# Altium project Pleiades_P01.PrjPcb (part 7 of 10)

## Sheet MOTOR_CONTROL.SchDoc
size 558 x 431 mm; SheetNumber: 13; SheetTotal: 25; Sheet_Name: MOTOR CONTROL; Size: 11x17
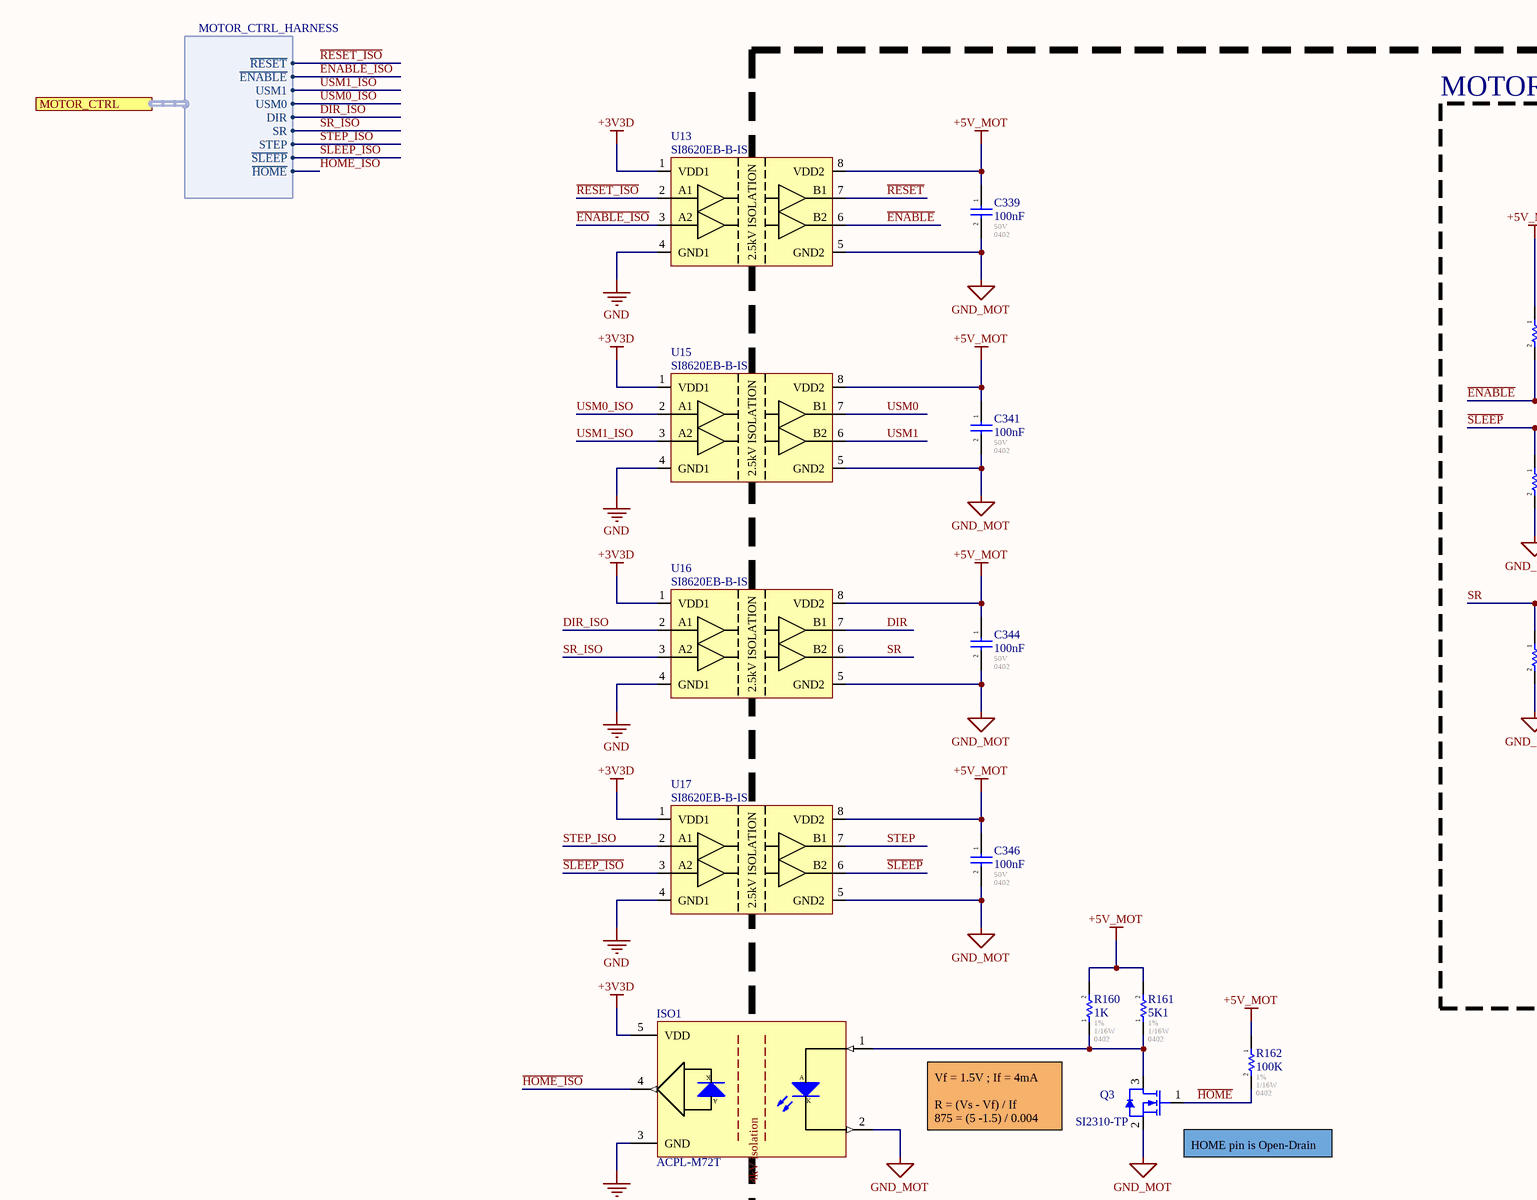
[diagram p42: MOTOR_CONTROL.SchDoc, top left]
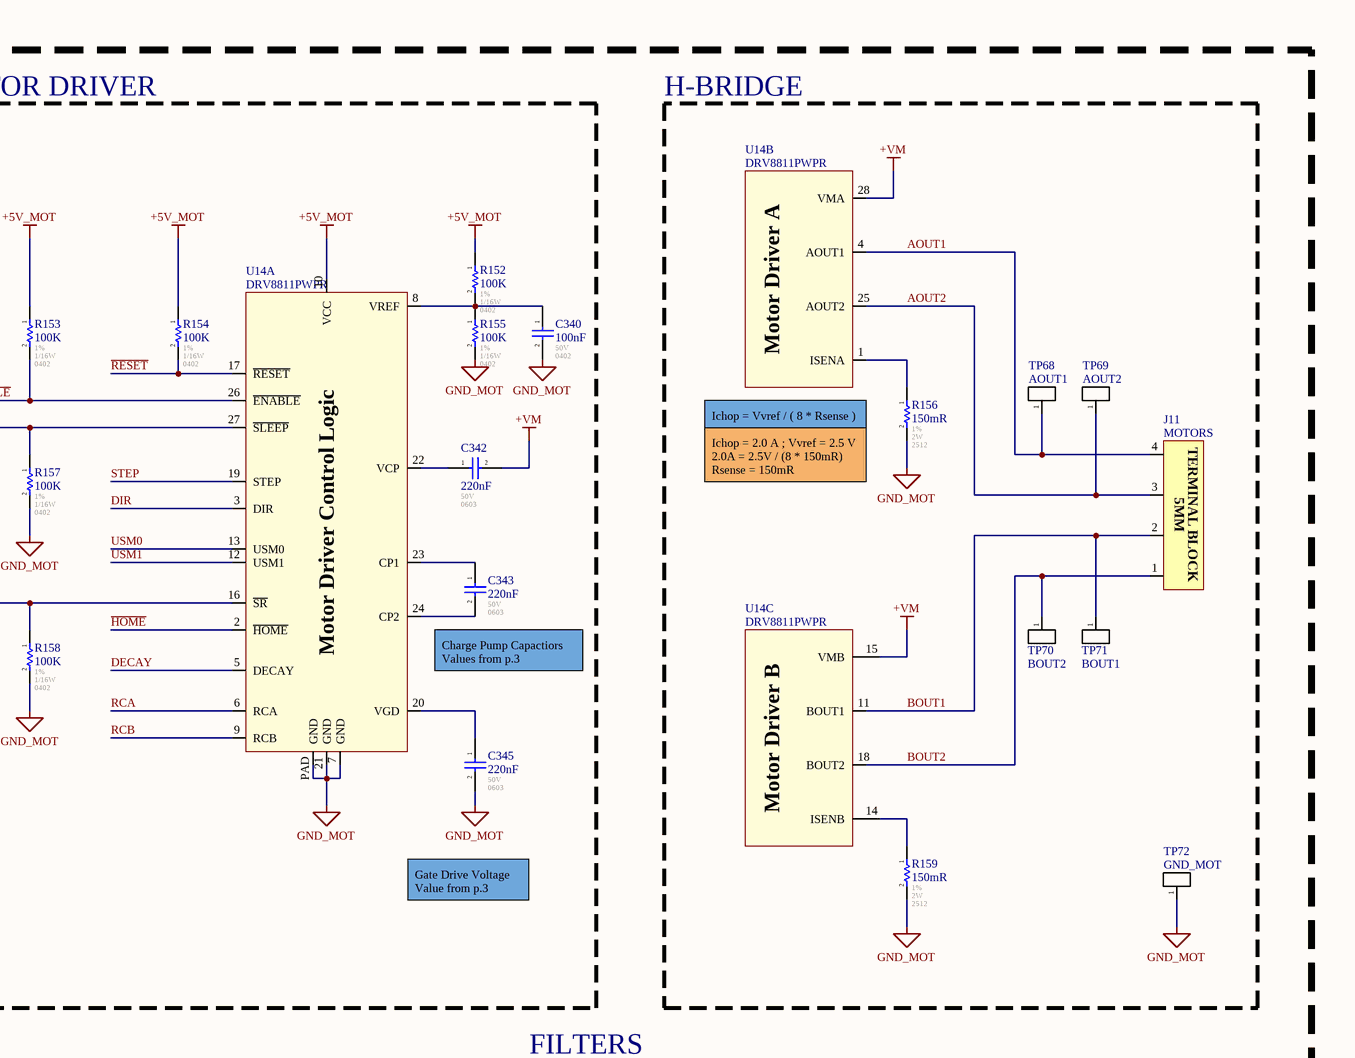
[diagram p43: MOTOR_CONTROL.SchDoc, top right]
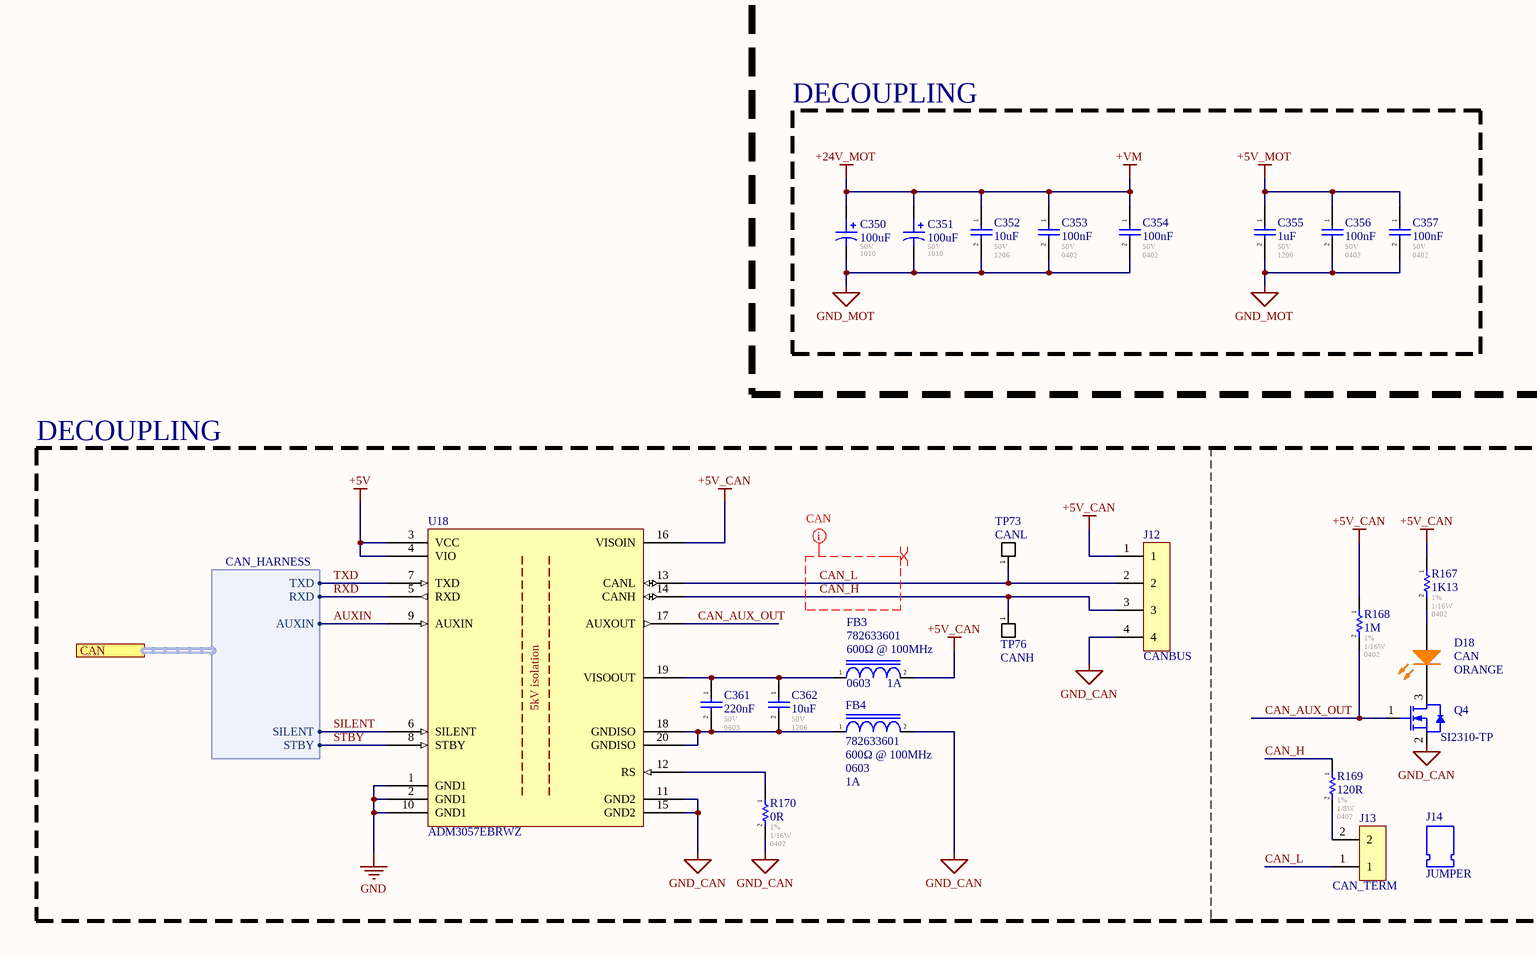
[diagram p44: MOTOR_CONTROL.SchDoc, bottom left]
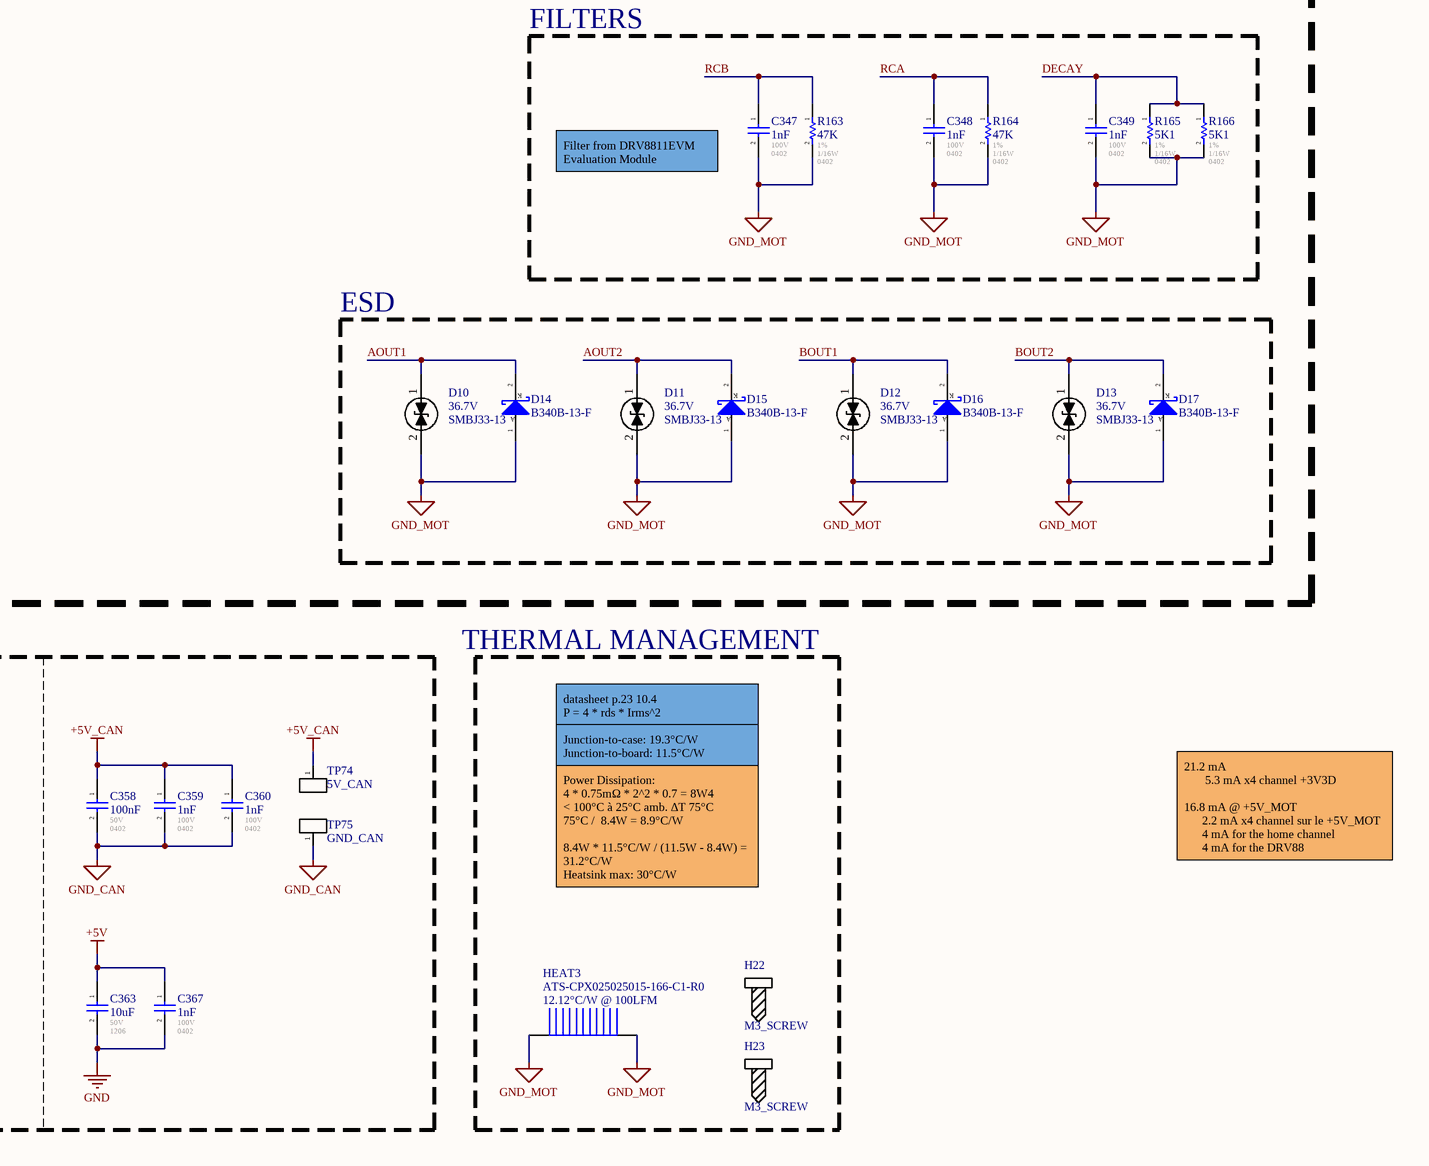
[diagram p45: MOTOR_CONTROL.SchDoc, bottom right]

### Parts
C339  100nF  Voltage - Rated: 50V  Footprint: 0402  [CAP_0402]
C340  100nF  Voltage - Rated: 50V  Footprint: 0402  [CAP_0402]
C341  100nF  Voltage - Rated: 50V  Footprint: 0402  [CAP_0402]
C342  220nF  Voltage - Rated: 50V  Footprint: 0603  [CAP_0603]
C343  220nF  Voltage - Rated: 50V  Footprint: 0603  [CAP_0603]
C344  100nF  Voltage - Rated: 50V  Footprint: 0402  [CAP_0402]
C345  220nF  Voltage - Rated: 50V  Footprint: 0603  [CAP_0603]
C346  100nF  Voltage - Rated: 50V  Footprint: 0402  [CAP_0402]
C347  1nF  Voltage - Rated: 100V  Footprint: 0402  [CAP_0402]
C348  1nF  Voltage - Rated: 100V  Footprint: 0402  [CAP_0402]
C349  1nF  Voltage - Rated: 100V  Footprint: 0402  [CAP_0402]
C350  value 100uF  Voltage: 50V  Package: 1010  [CAP_ALU_1010_vishay]  (hidden comment: MAL215099101E3)
C351  value 100uF  Voltage: 50V  Package: 1010  [CAP_ALU_1010_vishay]  (hidden comment: MAL215099101E3)
C352  10uF  Voltage - Rated: 50V  Footprint: 1206  [CAP_1206]
C353  100nF  Voltage - Rated: 50V  Footprint: 0402  [CAP_0402]
C354  100nF  Voltage - Rated: 50V  Footprint: 0402  [CAP_0402]
C355  1uF  Voltage - Rated: 50V  Footprint: 1206  [CAP_1206]
C356  100nF  Voltage - Rated: 50V  Footprint: 0402  [CAP_0402]
C357  100nF  Voltage - Rated: 50V  Footprint: 0402  [CAP_0402]
C358  100nF  Voltage - Rated: 50V  Footprint: 0402  [CAP_0402]
C359  1nF  Voltage - Rated: 100V  Footprint: 0402  [CAP_0402]
C360  1nF  Voltage - Rated: 100V  Footprint: 0402  [CAP_0402]
C361  220nF  Voltage - Rated: 50V  Footprint: 0603  [CAP_0603]
C362  10uF  Voltage - Rated: 50V  Footprint: 1206  [CAP_1206]
C363  10uF  Voltage - Rated: 50V  Footprint: 1206  [CAP_1206]
C367  1nF  Voltage - Rated: 100V  Footprint: 0402  [CAP_0402]
D10  SMBJ33-13  Voltage - Breakdown: 36.7V  [DO214AA (SMB)]
D11  SMBJ33-13  Voltage - Breakdown: 36.7V  [DO214AA (SMB)]
D12  SMBJ33-13  Voltage - Breakdown: 36.7V  [DO214AA (SMB)]
D13  SMBJ33-13  Voltage - Breakdown: 36.7V  [DO214AA (SMB)]
D14  B340B-13-F  [DO214AA (SMB)]
D15  B340B-13-F  [DO214AA (SMB)]
D16  B340B-13-F  [DO214AA (SMB)]
D17  B340B-13-F  [DO214AA (SMB)]
D18  CAN  value ORANGE  [LED_0603]
FB3  782633601  Impedance @ Freq: 600Ω @ 100MHz  Package / Case: 0603  Current Rating: 1A  [IND_0603]
FB4  782633601  Impedance @ Freq: 600Ω @ 100MHz  Package / Case: 0603  Current Rating: 1A  [IND_0603]
H22  M3_SCREW  (mechanical)
H23  M3_SCREW  (mechanical)
HEAT3  ATS-CPX025025015-166-C1-R0  Thermal Resistance: 12.12°C/W @ 100LFM  [ATS-CPX025025015-166-C1-R0]
ISO1  ACPL-M72T  [SOIC-5_4.4MM]
J11  MOTORS  [CONN_TERMINAL_OSTTA040161]
J12  CANBUS  [HEADER-4_100MIL]
J13  CAN_TERM  [HEADER-2_100MIL]
J14  JUMPER  (mechanical)
Q3  SI2310-TP  [TRX_NMOS_SI2310-TP]
Q4  SI2310-TP  [TRX_NMOS_SI2310-TP]
R152  100K  Tolerance: 1%  Power: 1/16W  Package / Case: 0402  [RES_0402]
R153  100K  Tolerance: 1%  Power: 1/16W  Package / Case: 0402  [RES_0402]
R154  100K  Tolerance: 1%  Power: 1/16W  Package / Case: 0402  [RES_0402]
R155  100K  Tolerance: 1%  Power: 1/16W  Package / Case: 0402  [RES_0402]
R156  150mR  Tolerance: 1%  Power: 2W  Package / Case: 2512  [RES_2512]
R157  100K  Tolerance: 1%  Power: 1/16W  Package / Case: 0402  [RES_0402]
R158  100K  Tolerance: 1%  Power: 1/16W  Package / Case: 0402  [RES_0402]
R159  150mR  Tolerance: 1%  Power: 2W  Package / Case: 2512  [RES_2512]
R160  1K  Tolerance: 1%  Power: 1/16W  Package / Case: 0402  [RES_0402]
R161  5K1  Tolerance: 1%  Power: 1/16W  Package / Case: 0402  [RES_0402]
R162  100K  Tolerance: 1%  Power: 1/16W  Package / Case: 0402  [RES_0402]
R163  47K  Tolerance: 1%  Power: 1/16W  Package / Case: 0402  [RES_0402]
R164  47K  Tolerance: 1%  Power: 1/16W  Package / Case: 0402  [RES_0402]
R165  5K1  Tolerance: 1%  Power: 1/16W  Package / Case: 0402  [RES_0402]
R166  5K1  Tolerance: 1%  Power: 1/16W  Package / Case: 0402  [RES_0402]
R167  1K13  Tolerance: 1%  Power: 1/16W  Package / Case: 0402  [RES_0402]
R168  1M  Tolerance: 1%  Power: 1/16W  Package / Case: 0402  [RES_0402]
R169  120R  Tolerance: 1%  Power: 1/8W  Package / Case: 0402  [RES_0402]
R170  0R  Tolerance: 1%  Power: 1/16W  Package / Case: 0402  [RES_0402]
TP68  AOUT1  [TP_HOLE]  (no BOM)
TP69  AOUT2  [TP_HOLE]  (no BOM)
TP70  BOUT2  [TP_HOLE]  (no BOM)
TP71  BOUT1  [TP_HOLE]  (no BOM)
TP72  GND_MOT  [TP_HOLE]  (no BOM)
TP73  CANL  [TP_PAD]  (no BOM)
TP74  5V_CAN  [TP_HOLE]  (no BOM)
TP75  GND_CAN  [TP_HOLE]  (no BOM)
TP76  CANH  [TP_PAD]  (no BOM)
U13  SI8620EB-B-IS  [ISO_SI8620EB-B-IS]
U14  DRV8811PWPR  [POW_MOTOR_DRV8811PWPR]  (parts A,B,C of 3)
U15  SI8620EB-B-IS  [ISO_SI8620EB-B-IS]
U16  SI8620EB-B-IS  [ISO_SI8620EB-B-IS]
U17  SI8620EB-B-IS  [ISO_SI8620EB-B-IS]
U18  ADM3057EBRWZ  [SOIC-20_7.5mm]

### Blocks framed on the sheet
MOTOR DRIVER: C340 C342 C343 C345 R152-R155 R157 R158 U14
H-BRIDGE: J11 R156 R159 TP68-TP72 U14
FILTERS: C347-C349 R163-R166
DECOUPLING: C350-C357
ESD: D10-D17
DECOUPLING: C358-C363 C367 D18 FB3 FB4 J12-J14 Q4 R167-R170 TP73-TP76 U18

### Ports
CAN (harness CAN_HARNESS), MOTOR_CTRL (harness MOTOR_CTRL_HARNESS)

### Harnesses
MOTOR_CTRL_HARNESS: DIR, SR, STEP, ~{SLEEP}, ~{HOME}, USM1, USM0, ~{RESET}, ~{ENABLE}
CAN_HARNESS: TXD, RXD, AUXIN, SILENT, STBY

### Nets
+3V3D: ISO1.5(VDD) U13.1(VDD1) U15.1(VDD1) U16.1(VDD1) U17.1(VDD1)
+5V: C363.1 C367.1 U18.3(VCC) U18.4(VIO)
+5V_CAN: C358.1 C359.1 C360.1 FB3.2 J12.1 R167.1 R168.1 TP74.1(A) U18.16(VISOIN)
+5V_MOT: C339.1 C341.1 C344.1 C346.1 C355.1 C356.1 C357.1 R152.1 R153.1 R154.1 R160.2 R161.2 R162.1 U13.8(VDD2) U14.10(VCC) U15.8(VDD2) U16.8(VDD2) U17.8(VDD2)
+24V_MOT: C342.2 C350.1 C351.1 C352.1 C353.1 C354.1 U14.15(VMB) U14.28(VMA)  [also labelled +VM]
GND: C363.2 C367.2 ISO1.3(GND) U13.4(GND1) U15.4(GND1) U16.4(GND1) U17.4(GND1) U18.1(GND1) U18.2(GND1) U18.10(GND1)
GND_CAN: C358.2 C359.2 C360.2 FB4.2 J12.4 Q4.2(S) R170.2 TP75.1(A) U18.11(GND2) U18.15(GND2)
GND_MOT: C339.2 C340.2 C341.2 C344.2 C345.2 C346.2 C347.2 C348.2 C349.2 C350.2 C351.2 C352.2 C353.2 C354.2 C355.2 C356.2 C357.2 D10.2(C) D11.2(C) D12.2(C) D13.2(C) D14.1(A) D15.1(A) D16.1(A) D17.1(A) HEAT3.1 HEAT3.2 ISO1.2(CATHODE) Q3.2(S) R155.2 R156.2 R157.2 R158.2 R159.2 R163.2 R164.2 R165.2 R166.2 TP72.1(A) U13.5(GND2) U14.7(GND) U14.21(GND) U14.PAD(GND) U15.5(GND2) U16.5(GND2) U17.5(GND2)
~{ENABLE}: R153.2 U13.6(B2) U14.26(~{ENABLE})  [project net ~{ENABLE_13}]
~{ENABLE_ISO}: U13.3(A2) ; port MOTOR_CTRL.~{ENABLE}
~{HOME}: Q3.1(G) R162.2 U14.2(~{HOME})  [project net ~{HOME_13}]
~{HOME_ISO}: ISO1.4(VOUT) ; port MOTOR_CTRL.~{HOME}
~{RESET}: R154.2 U13.7(B1) U14.17(~{RESET})  [project net ~{RESET_13}]
~{RESET_ISO}: U13.2(A1) ; port MOTOR_CTRL.~{RESET}
~{SLEEP}: R157.1 U14.27(~{SLEEP}) U17.6(B2)  [project net ~{SLEEP_13}]
~{SLEEP_ISO}: U17.3(A2) ; port MOTOR_CTRL.~{SLEEP}
AOUT1: D10.1(A) D14.2(K) J11.4 TP68.1(A) U14.4(AOUT1)  [project net AOUT1_13]
AOUT2: D11.1(A) D15.2(K) J11.3 TP69.1(A) U14.25(AOUT2)  [project net AOUT2_13]
AUXIN: U18.9(AUXIN) ; port CAN.AUXIN
BOUT1: D12.1(A) D16.2(K) J11.2 TP71.1(A) U14.11(BOUT1)  [project net BOUT1_13]
BOUT2: D13.1(A) D17.2(K) J11.1 TP70.1(A) U14.18(BOUT2)  [project net BOUT2_13]
CAN_AUX_OUT: Q4.1(G) R168.2 U18.17(AUXOUT)  [project net CAN_AUX_OUT_13]
CAN_H: J12.3 R169.1 TP76.1(A) U18.14(CANH)  [project net CAN_H_13]
CAN_L: J12.2 J13.1 TP73.1(A) U18.13(CANL)  [project net CAN_L_13]
DECAY: C349.1 R165.1 R166.1 U14.5(DECAY)  [project net DECAY_13]
DIR: U14.3(DIR) U16.7(B1)  [project net DIR_13]
DIR_ISO: U16.2(A1) ; port MOTOR_CTRL.DIR
RCA: C348.1 R164.1 U14.6(RCA)  [project net RCA_13]
RCB: C347.1 R163.1 U14.9(RCB)  [project net RCB_13]
RXD: U18.5(RXD) ; port CAN.RXD
SILENT: U18.6(SILENT) ; port CAN.SILENT
SR: R158.1 U14.16(~{SR}) U16.6(B2)  [project net SR_13]
SR_ISO: U16.3(A2) ; port MOTOR_CTRL.SR
STBY: U18.8(STBY) ; port CAN.STBY
STEP: U14.19(STEP) U17.7(B1)  [project net STEP_13]
STEP_ISO: U17.2(A1) ; port MOTOR_CTRL.STEP
TXD: U18.7(TXD) ; port CAN.TXD
USM0: U14.13(USM0) U15.7(B1)  [project net USM0_13]
USM0_ISO: U15.2(A1) ; port MOTOR_CTRL.USM0
USM1: U14.12(USM1) U15.6(B2)  [project net USM1_13]
USM1_ISO: U15.3(A2) ; port MOTOR_CTRL.USM1
NetC340_1: C340.1 R152.2 R155.1 U14.8(VREF)
NetC342_1: C342.1 U14.22(VCP)
NetC343_1: C343.1 U14.23(CP1)
NetC343_2: C343.2 U14.24(CP2)
NetC345_1: C345.1 U14.20(VGD)
NetC361_1: C361.1 C362.1 FB3.1 U18.19(VISOOUT)
NetC361_2: C361.2 C362.2 FB4.1 U18.18(GNDISO) U18.20(GNDISO)
NetD18_1: D18.1(A) R167.2
NetD18_2: D18.2(K) Q4.3(D)
NetISO1_1: ISO1.1(ANODE) Q3.3(D) R160.1 R161.1
NetJ13_2: J13.2 R169.2
NetR156_1: R156.1 U14.1(ISENA)
NetR159_1: R159.1 U14.14(ISENB)
NetR170_1: R170.1 U18.12(RS)

### Layout directives
differential pair: CAN_H, CAN_L
net class CAN: CAN_H, CAN_L

### Notes on the sheet
- (near R156) Ichop = 2.0 A ; Vvref = 2.5 V
  2.0A = 2.5V / (8 * 150mR)
  Rsense = 150mR
- Ichop = Vvref / ( 8 * Rsense )
- Charge Pump Capactiors
  Values from p.3
- Gate Drive Voltage
  Value from p.3
- (near R160) Vf = 1.5V ; If = 4mA
  R = (Vs - Vf) / If
  875 = (5 -1.5) / 0.004
- (near Q3) HOME pin is Open-Drain
- (near C347) Filter from DRV8811EVM Evaluation Module
- THERMAL MANAGEMENT
- datasheet p.23 10.4
  P = 4 * rds * Irms^2
- Junction-to-case: 19.3°C/W
  Junction-to-board: 11.5°C/W
- 21.2 mA
  5.3 mA x4 channel +3V3D
  16.8 mA @ +5V_MOT
  2.2 mA x4 channel sur le +5V_MOT
  4 mA for the home channel
  4 mA for the DRV88
- Power Dissipation:
  4 * 0.75mΩ * 2^2 * 0.7 = 8W4
  < 100°C à 25°C amb. ΔT 75°C
  75°C /  8.4W = 8.9°C/W
  8.4W * 11.5°C/W / (11.5W - 8.4W) = 31.2°C/W
  Heatsink max: 30°C/W
- Sheet Name
- Project Title
- Global Project
- Revision
- Size
- Date
- Group
- Sheet
- of
- Filename
- Designers
- (in symbol ACPL-M72T) K; A; 4kV isolation
- (in symbol ADM3057EBRWZ) 5kV isolation
- (in symbol CONN_TERMINAL_OSTTC040162) 5MM; TERMINAL BLOCK
- (in symbol ISO_SI8620EB-B-IS) 2.5kV ISOLATION
- (in symbol POW_MOTOR_DRV8811PWPR, part A) Motor Driver Control Logic
- (in symbol POW_MOTOR_DRV8811PWPR, part B) Motor Driver A
- (in symbol POW_MOTOR_DRV8811PWPR, part C) Motor Driver B

### Library data of the parts
C339-C341 C344 C346 C353 C354 C356-C358 = CAP_CER: as C100 on sheet FPGA_MISC; Operating Temperature: -55C - 125C; Temperature Coefficient: X7R; ComponentLink1Description: Digikey; ComponentLink1URL: [Digikey Link]; Part#: GCM155R71H104KE02J; ComponentLink2Description: Datasheet; ComponentLink2URL: [Datasheet Link]; Tolerance: 10%; Ratings: AEC-Q200
C342 C343 C345 C361 = CAP_CER: GCM188R71H224KA64D / 0603 220nF 10% X7R Ceramic Capacitor; Mfr: Murata; Operating Temperature: -55C - 125C; Temperature Coefficient: X7R; ComponentLink1Description: Digikey; ComponentLink1URL: [Digikey Link]; Part#: GCM188R71H224KA64D; ComponentLink2Description: Datasheet; ComponentLink2URL: [Datasheet Link]; Tolerance: 10%; Ratings: AEC-Q200
C347-C349 C359 C360 C367 = CAP_CER: GCM155R72A102KA37D / 0402 1nF 10% X7R Ceramic Capacitor; Mfr: Murata; Operating Temperature: -55C - 125C; Temperature Coefficient: X7R; ComponentLink1Description: Digikey; ComponentLink1URL: [Digikey Link]; Part#: GCM155R72A102KA37D; ComponentLink2Description: Datasheet; ComponentLink2URL: [Datasheet Link]; Tolerance: 10%; Ratings: AEC-Q200
C350 C351 = CAP_ALU_MAL215099101E3: CAP - ALU 100uF 20% 50V - 1010; Current: 490mA; Mfg: Vishay Dale; Mfg Part Number: MAL215099101E3; HelpURL: http://www.vishay.com/docs/28395/150crz.pdf; CreatedBy: Jonathan Bouchard; Temperature: -55°C to 125°C; Power: *; Supplier 1: Digikey; Supplier Part Number 1: 4399PHDKR-ND; Precision: 20%
C352 C362 C363 = CAP_CER: as C105 on sheet FPGA_MISC; Operating Temperature: -55C - 85C; Temperature Coefficient: X5R; ComponentLink1Description: Digikey; ComponentLink1URL: [Digikey Link]; ComponentLink2Description: Datasheet; ComponentLink2URL: [Datasheet Link]; Tolerance: 10%; Ratings: AEC-Q200; Part#: GRT31CR61H106KE01L
  C362 C363: Supplier 1: Arrow Electronics; Supplier Part Number 1: GRT31CR61H106KE01L
C355 = CAP_CER: GCJ31CR71H105KA12L / 1206 1uF 10% X7R Ceramic Capacitor; Mfr: Murata; Operating Temperature: -55C - 125C; Temperature Coefficient: X7R; ComponentLink1Description: Digikey; ComponentLink1URL: [Digikey Link]; Part#: GCJ31CR71H105KA12L; ComponentLink2Description: Datasheet; ComponentLink2URL: [Datasheet Link]; Tolerance: 10%; Ratings: AEC-Q200
D10-D13 = DIODE_TVS: 53.3V Clamp 11.3A Ipp Tvs Diode Surface Mount SMB; Mfr: SMBJ33CAQ-13-F; Voltage - Reverse: 33V; Operating Temperature: *; Package / Case: SMB; Current: 11.3A; ComponentLink1Description: Digikey; ComponentLink1URL: https://www.digikey.ca/en/products/detail/diodes-incorporated/SMBJ33CAQ-13-F/9738859
D14-D17 = DIODE_SHOTTKEY: Generic Shottkey Diode; Mfr: Diodes Incorporated; Diode Type: Schottky; Current: 3A; Reverse Voltage: 40V; Forward Voltage: 500mV @ 3A; Qualification: AEC-Q101; Package / Case: SMB; ComponentLink1Description: Digikey; ComponentLink1URL: https://www.digikey.ca/en/products/detail/diodes-incorporated/B340B-13-F/768869; ComponentLink2Description: Octopart; ComponentLink2URL: https://octopart.com/b340b-13-f-diodes+inc.-325817?r=sp; Supplier 1: Future Electronics; Supplier Part Number 1: 6160261
D18 = LED_SML-311DTT86: LED - 611nM ORANGE 2mA - 0603; Voltage: 1.8V; Mfg: ROHM Semiconductor; Power: 44mW; Current: 2mA; HelpURL: http://media.digikey.com/pdf/Data%20Sheets/Rohm%20PDFs/SML-311%20Series.pdf; CreatedBy: Jonathan Bouchard; Temperature: -40°C to 85°C; Package: 0603; Precision: *; Mfg Part Number: SML-311DTT86; Supplier 1: Digikey; Supplier Part Number 1: 511-1303-1-ND
FB3 FB4 = FERRITE_BEAD: 600 Ohms @ 100 MHz 1 Signal Line Ferrite Bead 0603 (1608 Metric) 1A 200mOhm; Manufacturer: Wurth Elektronik; Resistance: 200mR; Operating Temperature: -55C - 125C; Rating: AEC-Q200; ComponentLink1Description: Digikey; ComponentLink1URL: https://www.digikey.ca/en/products/detail/w%C3%BCrth-elektronik/782633601/5168802; ComponentLink3Description: Octopart; ComponentLink3URL: https://octopart.com/782633601-wurth+elektronik-56466764; Supplier 1: Digikey; Supplier Part Number 1: 732-6703-1-ND; ComponentLink5Description: Datasheet; ComponentLink5URL: https://www.we-online.com/components/products/datasheet/782633601.pdf
HEAT3 = HEATSINK_ATS-CPX025025015-166-C1-R0: Heatsink Aluminium; Mfr: Advanced Thermal Solutions Inc.; Hole Size: 3.175mm; Hole-to-hole: 42.42mm; Fin Height: 15mm; Length: 25mm; Width: 25mm; Material: Aluminium; ComponentLink1Description: Digikey; ComponentLink1URL: https://www.digikey.ca/en/products/detail/advanced-thermal-solutions-inc/ATS-CPX025025015-166-C1-R0/4753829; ComponentLink2Description: Mfr; ComponentLink2URL: https://www.qats.com/Search/HeatSink/2670.aspx; Supplier 1: Digikey; Supplier Part Number 1: ATS35911-ND
ISO1 = ACPL-M72T: Logic Output Optoisolator Push-Pull, Totem Pole 4000Vrms 1 Channel 25kV/µs CMTI 5-SO; Mfr: Broadcom Limited; Number of channels: 1; Common Mode Transient: 25kV/us; Voltage - Forward: 1.5V; Current - Forward: 20mA; Voltage - Supply: 3V - 5.5V; Qualification: AEC-Q100; Voltage - Isolation: 4000Vrms; Output Topology: Push-Pull; Operating Temperature: -40C - 125C; Package: SOIC6 - 5 Leads; ComponentLink1Description: Digikey; ComponentLink1URL: https://www.digikey.ca/en/products/detail/broadcom-limited/ACPL-M72T-000E/2347227; ComponentLink2Description: Datasheet; ComponentLink2URL: https://docs.broadcom.com/doc/AV02-2180EN
J11 = CONN_TERMINAL_OSTTC040162: CONN -  TERMINAL BLOCK 4POS 5MM - TH; Mfg: On Shore Technology Inc.; Voltage: *; Current: *; Power: *; Mfg Part Number: OSTTC040162; HelpURL: http://www.on-shore.com/wp-content/uploads/2015/09/osttcxx0162.pdf; CreatedBy: Jonathan Bouchard; Temperature: -30°C ~ 105°C; Value: *; Precision: *; Package: TH-4; Supplier 1: Digikey; Supplier Part Number 1: ED2602-ND
J12 = HEADER_4
J13 = HEADER_2
Q3 Q4 = TRX_NMOS_SI2310-TP: TRX - MOSFET N-CH 60V 3A - SOT-23; Manufacturer #1: Micro Commercial Co; Power Max: 350mW; Voltage rating: 60V (Vds max), 2V (Vgs @ 250uA); Polarized: Yes; Magnetic Material: UNKNOWN; GRAMS Lib Spec: 2.8c; Current Rating: 3A; Manufacturer #2: *; Value: *; Part Number #1: SI2310-TP; Part Number #2: *; HelpURL: https://www.mccsemi.com/pdf/Products/SI2310(SOT-23)-A.pdf; Supplier 1: Digi-Key; Supplier Part Number 1: SI2310-TPMSCT-ND; Assembly Type: SMD; Temperature: -55°C ~ 150°C (TJ); Package: SOT-23; CreatedBy/Date: Louis-Daniel Gaulin / 20-02-2020; Tolerance: *; VerifiedBy: C.Paulin - 21/02/2020; Cryo: UNKNOWN
R152-R155 R157 R158 R160-R167 R169 R170 = RESISTOR: Automotive: AEC-Q200; Operating Temperature: *; # Digikey: *; ComponentLink1Description: Digikey; ComponentLink1URL: *; # Manufacturer: *
R156 R159 = RESISTOR: CSRN2512FKR150; Automotive: AEC-Q200; Operating Temperature: -55C - 155C; ComponentLink1Description: Digikey; ComponentLink1URL: https://www.digikey.ca/fr/products/detail/stackpole-electronics-inc/CSRN2512FKR150/1788109; Part #: CSRN2512FKR150
R168 = RESISTOR: 1M 0402 1% 1/16W Resistor; Automotive: AEC-Q200; Operating Temperature: *; # Digikey: *; ComponentLink1Description: Digikey; ComponentLink1URL: *; # Manufacturer: *
TP68-TP72 TP74 TP75 = TESTPOINT: Test Point; ClassName: Testpoint
TP73 TP76 = TESTPOINT_PAD: Test Point
U13 U15-U17 = ISO_SI8620EB-B-IS: ISO - Dual-Channel Digital Isolator (default HI) - 8-SOIC; Manufacturer #1: Silicon Labs; Voltage Rating: 2.5-5.5V; GRAMS Lib Spec: 2.8; Magnetic Material: Unknown; Polarized: Yes; Value: *; Tolerance: *; Current Rating: *; Power Max: *; HelpURL: https://www.silabs.com/documents/public/data-sheets/si861x-2x-datasheet.pdf; CreatedBy/Date: Joel Lemay 2018-06-05; VerifiedBy: Caroline Paulin - 12 sept 2018; Temperature: -40°C ~ 125°C; Package: 8-SOIC; Manufacturer #2: *; Assembly Type: SMD; Part Number #2: *; Part Number #1: SI8620EB-B-IS; Supplier 1: Digi-Key; Supplier Part Number 1: SI8620EB-B-IS-ND; Cryo: UNKNOWN
U14 = POW_MOTOR_DRV8811PWPR: POW - STEPPER MOTOR DRIVER - SOP-28; Voltage: 3 V ~ 5.5 V / 8 V ~ 38 V; Mfg: Texas Instrument; Current: *; Power: *; Mfg Part Number: DRV8811PWPR; HelpURL: http://www.ti.com/lit/ds/symlink/drv8811.pdf; CreatedBy: Jonathan Bouchard; Temperature: -40°C ~ 150°C (TJ); Value: *; Precision: *; Package: SOP-28; Supplier 1: Digikey; Supplier Part Number 1: 296-24591-1-ND
U18 = ADM3057EBRWZ: 1/1 Transceiver, Isolated CANbus 20-SOIC; Mfr: Analog Devices; Protocol: CAN; Data Rate: 12Mbps; Mode: Full Duplex; Voltage - Supply: 0.5V - 6V; Isolation: 5kV; Number of Drivers: 1/1; Operating Temperature: -40C - 105C; ComponentLink1Description: Digikey; ComponentLink1URL: https://www.digikey.ca/en/products/detail/analog-devices-inc/ADM3057EBRWZ/9806175; ComponentLink2Description: Datasheet; ComponentLink2URL: https://www.analog.com/media/en/technical-documentation/data-sheets/ADM3055E-3057E.pdf; ComponentLink3Description: Analog Devices; ComponentLink3URL: https://www.analog.com/en/products/adm3057e.html; ComponentLink4Description: Octopart; ComponentLink4URL: https://octopart.com/adm3057ebrwz-analog+devices-96773388?r=sp; Supplier 1: Mouser; Supplier Part Number 1: 584-ADM3057EBRWZ

## Sheet USER_IO.SchDoc
size Tabloid; SheetNumber: 14; SheetTotal: 25; Sheet_Name: MECHANICAL; Size: 11x17
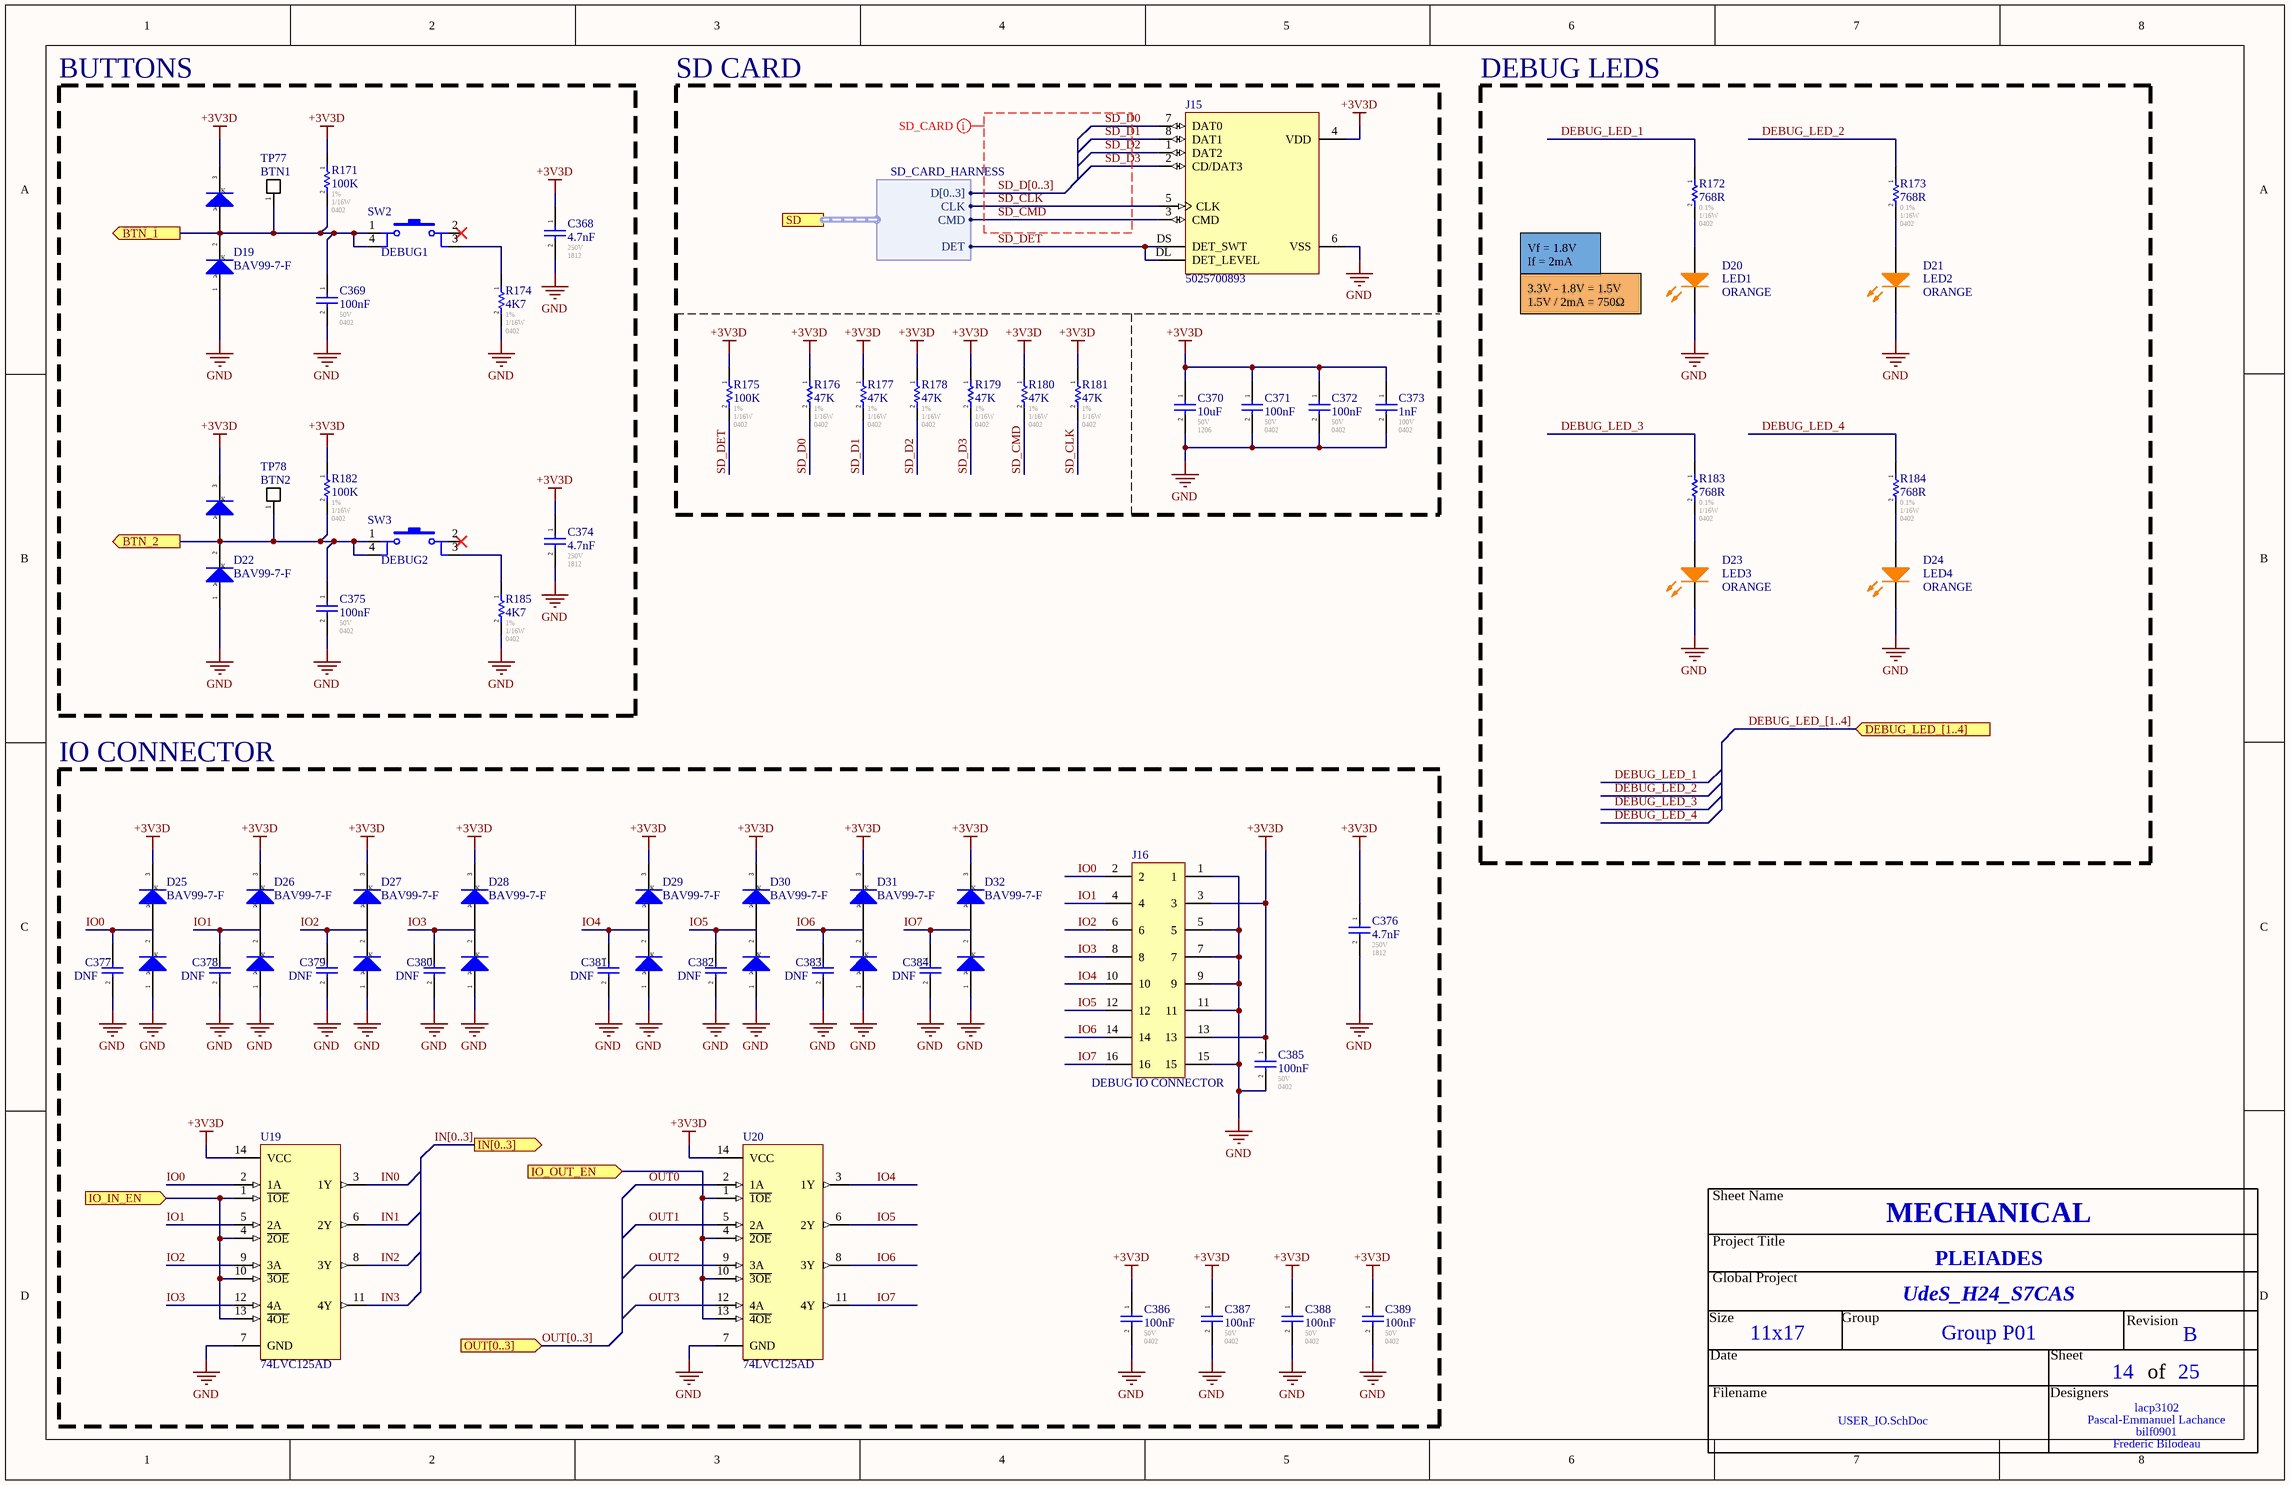
[diagram p46: USER_IO.SchDoc]

### Parts
C368  4.7nF  Voltage - Rated: 250V  Footprint: 1812  [CAP_1812]
C369  100nF  Voltage - Rated: 50V  Footprint: 0402  [CAP_0402]
C370  10uF  Voltage - Rated: 50V  Footprint: 1206  [CAP_1206]
C371  100nF  Voltage - Rated: 50V  Footprint: 0402  [CAP_0402]
C372  100nF  Voltage - Rated: 50V  Footprint: 0402  [CAP_0402]
C373  1nF  Voltage - Rated: 100V  Footprint: 0402  [CAP_0402]
C374  4.7nF  Voltage - Rated: 250V  Footprint: 1812  [CAP_1812]
C375  100nF  Voltage - Rated: 50V  Footprint: 0402  [CAP_0402]
C376  4.7nF  Voltage - Rated: 250V  Footprint: 1812  [CAP_1812]
C377  DNF  [CAP_0402]
C378  DNF  [CAP_0402]
C379  DNF  [CAP_0402]
C380  DNF  [CAP_0402]
C381  DNF  [CAP_0402]
C382  DNF  [CAP_0402]
C383  DNF  [CAP_0402]
C384  DNF  [CAP_0402]
C385  100nF  Voltage - Rated: 50V  Footprint: 0402  [CAP_0402]
C386  100nF  Voltage - Rated: 50V  Footprint: 0402  [CAP_0402]
C387  100nF  Voltage - Rated: 50V  Footprint: 0402  [CAP_0402]
C388  100nF  Voltage - Rated: 50V  Footprint: 0402  [CAP_0402]
C389  100nF  Voltage - Rated: 50V  Footprint: 0402  [CAP_0402]
D19  BAV99-7-F  [SOT23-3]
D20  LED1  value ORANGE  [LED_0603]
D21  LED2  value ORANGE  [LED_0603]
D22  BAV99-7-F  [SOT23-3]
D23  LED3  value ORANGE  [LED_0603]
D24  LED4  value ORANGE  [LED_0603]
D25  BAV99-7-F  [SOT23-3]
D26  BAV99-7-F  [SOT23-3]
D27  BAV99-7-F  [SOT23-3]
D28  BAV99-7-F  [SOT23-3]
D29  BAV99-7-F  [SOT23-3]
D30  BAV99-7-F  [SOT23-3]
D31  BAV99-7-F  [SOT23-3]
D32  BAV99-7-F  [SOT23-3]
J15  5025700893  [MICROSD_5025700893]
J16  DEBUG IO CONNECTOR  [HEADER-16_100MIL]
R171  100K  Tolerance: 1%  Power: 1/16W  Package / Case: 0402  [RES_0402]
R172  768R  Tolerance: 0.1%  Power: 1/16W  Package / Case: 0402  [RES_0402]
R173  768R  Tolerance: 0.1%  Power: 1/16W  Package / Case: 0402  [RES_0402]
R174  4K7  Tolerance: 1%  Power: 1/16W  Package / Case: 0402  [RES_0402]
R175  100K  Tolerance: 1%  Power: 1/16W  Package / Case: 0402  [RES_0402]
R176  47K  Tolerance: 1%  Power: 1/16W  Package / Case: 0402  [RES_0402]
R177  47K  Tolerance: 1%  Power: 1/16W  Package / Case: 0402  [RES_0402]
R178  47K  Tolerance: 1%  Power: 1/16W  Package / Case: 0402  [RES_0402]
R179  47K  Tolerance: 1%  Power: 1/16W  Package / Case: 0402  [RES_0402]
R180  47K  Tolerance: 1%  Power: 1/16W  Package / Case: 0402  [RES_0402]
R181  47K  Tolerance: 1%  Power: 1/16W  Package / Case: 0402  [RES_0402]
R182  100K  Tolerance: 1%  Power: 1/16W  Package / Case: 0402  [RES_0402]
R183  768R  Tolerance: 0.1%  Power: 1/16W  Package / Case: 0402  [RES_0402]
R184  768R  Tolerance: 0.1%  Power: 1/16W  Package / Case: 0402  [RES_0402]
R185  4K7  Tolerance: 1%  Power: 1/16W  Package / Case: 0402  [RES_0402]
SW2  DEBUG1  [SWI_TACT_B3SN-3012P]
SW3  DEBUG2  [SWI_TACT_B3SN-3012P]
TP77  BTN1  [TP_PAD]  (no BOM)
TP78  BTN2  [TP_PAD]  (no BOM)
U19  74LVC125AD  [SOIC-14_3.8MM]
U20  74LVC125AD  [SOIC-14_3.8MM]

### Blocks framed on the sheet
BUTTONS: C368 C369 C374 C375 D19 D22 R171 R174 R182 R185 SW2 SW3 TP77 TP78
SD CARD: C370-C373 J15 R175-R181
DEBUG LEDS: D20 D21 D23 D24 R172 R173 R183 R184
IO CONNECTOR: C376-C389 D25-D32 J16 U19 U20

### Ports
BTN_1 (out), BTN_2 (out), DEBUG_LED_[1..4] (in), IN[0..3] (out), IO_IN_EN (in), IO_OUT_EN (in), OUT[0..3] (in), SD (harness SD_CARD_HARNESS)

### Harnesses
SD_CARD_HARNESS: CMD, D[0..3], DET, CLK

### Nets
+3V3D: C368.1 C370.1 C371.1 C372.1 C373.1 C374.1 C376.1 C385.1 C386.1 C387.1 C388.1 C389.1 D19.3(K) D22.3(K) D25.3(K) D26.3(K) D27.3(K) D28.3(K) D29.3(K) D30.3(K) D31.3(K) D32.3(K) J15.4(VDD) J16.3 J16.13 R171.1 R175.1 R176.1 R177.1 R178.1 R179.1 R180.1 R181.1 R182.1 U19.14(VCC) U20.14(VCC)
GND: C368.2 C369.2 C370.2 C371.2 C372.2 C373.2 C374.2 C375.2 C376.2 C377.2 C378.2 C379.2 C380.2 C381.2 C382.2 C383.2 C384.2 C385.2 C386.2 C387.2 C388.2 C389.2 D19.1(A) D20.2(K) D21.2(K) D22.1(A) D23.2(K) D24.2(K) D25.1(A) D26.1(A) D27.1(A) D28.1(A) D29.1(A) D30.1(A) D31.1(A) D32.1(A) J15.6(VSS) J16.1 J16.5 J16.7 J16.9 J16.11 J16.15 R174.2 R185.2 U19.7(GND) U20.7(GND)
BTN_1: C369.1 D19.2(K) R171.2 SW2.1 SW2.4 TP77.1(A) ; port BTN_1
BTN_2: C375.1 D22.2(K) R182.2 SW3.1 SW3.4 TP78.1(A) ; port BTN_2
DEBUG_LED_1: R172.1
DEBUG_LED_2: R173.1
DEBUG_LED_3: R183.1
DEBUG_LED_4: R184.1
IN0: U19.3(1Y)
IN1: U19.6(2Y)
IN2: U19.8(3Y)
IN3: U19.11(4Y)
IO0: C377.1 D25.2(K) J16.2 U19.2(1A)  [project net IO0_14]
IO1: C378.1 D26.2(K) J16.4 U19.5(2A)  [project net IO1_14]
IO2: C379.1 D27.2(K) J16.6 U19.9(3A)  [project net IO2_14]
IO3: C380.1 D28.2(K) J16.8 U19.12(4A)  [project net IO3_14]
IO4: C381.1 D29.2(K) J16.10 U20.3(1Y)  [project net IO4_14]
IO5: C382.1 D30.2(K) J16.12 U20.6(2Y)  [project net IO5_14]
IO6: C383.1 D31.2(K) J16.14 U20.8(3Y)  [project net IO6_14]
IO7: C384.1 D32.2(K) J16.16 U20.11(4Y)  [project net IO7_14]
IO_IN_EN: U19.1(~{1OE}) U19.4(~{2OE}) U19.10(~{3OE}) U19.13(~{4OE}) ; port IO_IN_EN
IO_OUT_EN: U20.1(~{1OE}) U20.4(~{2OE}) U20.10(~{3OE}) U20.13(~{4OE}) ; port IO_OUT_EN
OUT0: U20.2(1A)
OUT1: U20.5(2A)
OUT2: U20.9(3A)
OUT3: U20.12(4A)
SD_CLK: J15.5(CLK) R181.2 ; port SD.CLK
SD_CMD: J15.3(CMD) R180.2 ; port SD.CMD
SD_D0: J15.7(DAT0) R176.2
SD_D1: J15.8(DAT1) R177.2
SD_D2: J15.1(DAT2) R178.2
SD_D3: J15.2(CD/DAT3) R179.2
SD_DET: J15.DL(DET_LEVEL) J15.DS(DET_SWT) R175.2 ; port SD.DET
NetD20_1: D20.1(A) R172.2
NetD21_1: D21.1(A) R173.2
NetD23_1: D23.1(A) R183.2
NetD24_1: D24.1(A) R184.2
NetR174_1: R174.1 SW2.3
NetR185_1: R185.1 SW3.3

Not connected (* = marked no-connect by the designer): SW2 2*; SW3 2*

### Buses and harness runs
bus DEBUG_LED_[1..4] = port DEBUG_LED_[1..4]
bus IN[0..3] = port IN[0..3]
bus OUT[0..3] = port OUT[0..3]
bus SD_D[0..3]

### Layout directives
net class SD_CARD: SD_CLK, SD_CMD, SD_D0, SD_D1, SD_D2, SD_D3, SD_D[0..3]

### Notes on the sheet
- Vf = 1.8V
  If = 2mA
- 3.3V - 1.8V = 1.5V
  1.5V / 2mA = 750Ω
- Sheet Name
- Project Title
- Global Project
- Revision
- Size
- Date
- Group
- Sheet
- of
- Filename
- Designers

### Library data of the parts
C368 C374 C376 = CAP_CER: GA343DR7GD472KW01L / 0402 4.7nF 10% X7R 1812 250VAC Ceramic Capacitor; Mfr: Murata; Ratings: Y3 - Safety; Operating Temperature: -55C - 125C; Temperature Coefficient: X7R; ComponentLink1Description: Digikey; ComponentLink1URL: https://www.digikey.ca/en/products/detail/murata-electronics/GA343DR7GD472KW01L/789292; ComponentLink2Description: Datasheet; ComponentLink2URL: https://search.murata.co.jp/Ceramy/image/img/A01X/G101/ENG/GA343DR7GD472KW01-01.pdf; ComponentLink3Description: Octopart; ComponentLink3URL: https://octopart.com/ga343dr7gd472kw01l-murata-197048?r=sp; Tolerance: 10%; Part#: GA343DR7GD472KW01L; ComponentLink4Description: Murata; ComponentLink4URL: https://www.murata.com/en-us/products/productdetail?partno=GA343DR7GD472KW01%23
C369 C371 C372 C375 C385-C389 = CAP_CER: GCM155R71H104KE02J / 0402 100nF 10% X7R Ceramic Capacitor; Mfr: Murata; Operating Temperature: -55C - 125C; Temperature Coefficient: X7R; ComponentLink1Description: Digikey; ComponentLink1URL: [Digikey Link]; Part#: GCM155R71H104KE02J; ComponentLink2Description: Datasheet; ComponentLink2URL: [Datasheet Link]; Tolerance: 10%; Ratings: AEC-Q200
C370 = CAP_CER: GRT31CR61H106KE01L / 1206 10uF 10% X5R Ceramic Capacitor; Mfr: Murata; Operating Temperature: -55C - 85C; Temperature Coefficient: X5R; ComponentLink1Description: Digikey; ComponentLink1URL: [Digikey Link]; ComponentLink2Description: Datasheet; ComponentLink2URL: [Datasheet Link]; Tolerance: 10%; Ratings: AEC-Q200; Supplier 1: Arrow Electronics; Supplier Part Number 1: GRT31CR61H106KE01L; Part#: GRT31CR61H106KE01L
C373 = CAP_CER: GCM155R72A102KA37D / 0402 1nF 10% X7R Ceramic Capacitor; Mfr: Murata; Operating Temperature: -55C - 125C; Temperature Coefficient: X7R; ComponentLink1Description: Digikey; ComponentLink1URL: [Digikey Link]; Part#: GCM155R72A102KA37D; ComponentLink2Description: Datasheet; ComponentLink2URL: [Datasheet Link]; Tolerance: 10%; Ratings: AEC-Q200
C377-C384 = CAP_CER: ComponentLink1Description: Digikey; ComponentLink1URL: [Digikey Link]; ComponentLink2Description: Datasheet; ComponentLink2URL: [Datasheet Link]
D19 D22 D25-D32 = DIODE_TVS_DUAL: Diode Array 1 Pair Series Connection 75 V 300mA (DC) Surface Mount TO-236-3, SC-59, SOT-23-3; Mfr: Diodes Incorporated; Voltage - DC Reverse: 75V; Voltage - Forward: 1.25V @ 150mA; Reverse Recovery Time: 4ns; Capacitance: 2pF; Current - Reverse Leakage: 2.5µA @ 75V; Operating Temperature: -65C - 150C; Package / Case: SOT-23-3; Current: 300mA; ComponentLink1Description: Digikey; ComponentLink1URL: https://www.digikey.ca/en/products/detail/diodes-incorporated/BAV99-7-F/815018; ComponentLink2Description: Datasheet; ComponentLink2URL: https://www.diodes.com/assets/Datasheets/BAV99.pdf; ComponentLink3Description: Octopart; ComponentLink3URL: https://octopart.com/bav99-7-f-diodes+inc.-326328; Supplier 1: Future Electronics; Supplier Part Number 1: 3851920
D20 D21 D23 D24 = LED_SML-311DTT86: LED - 611nM ORANGE 2mA - 0603; Voltage: 1.8V; Mfg: ROHM Semiconductor; Power: 44mW; Current: 2mA; HelpURL: http://media.digikey.com/pdf/Data%20Sheets/Rohm%20PDFs/SML-311%20Series.pdf; CreatedBy: Jonathan Bouchard; Temperature: -40°C to 85°C; Package: 0603; Precision: *; Mfg Part Number: SML-311DTT86; Supplier 1: Digikey; Supplier Part Number 1: 511-1303-1-ND
J15 = MICROSD_10: 10 (8 + 2) Position Card Connector Secure Digital - microSD™ Surface Mount, Right Angle Gold
J16 = HEADER_16
R171-R185 = RESISTOR: Automotive: AEC-Q200; Operating Temperature: *; # Digikey: *; ComponentLink1Description: Digikey; ComponentLink1URL: *; # Manufacturer: *
SW2 SW3 = SWI_TACT_B3SN-3012P: SWI - TACT SPST-NO 0.05A 24V - 4-SMD; Current: 50mA; Mfg: Omron; Mfg Part Number: B3SN-3012P; HelpURL: http://www.omron.com/ecb/products/pdf/en-b3sn.pdf; CreatedBy: Jonathan Bouchard; Temperature: -25°C ~ 70°C; Power: *; Precision: *; Package: 4-SMD; Value: *; Voltage: 24V; Supplier 1: Digikey; Supplier Part Number 1: SW261CT-ND
TP77 TP78 = TESTPOINT_PAD: Test Point
U19 U20 = 74LVC125AD,118: Buffer, Non-Inverting 4 Element 1 Bit per Element 3-State Output 14-SO; Mfr: Nexperia; Number of Elements: 4; Voltage - Supply: 1.2V - 3.6V; Output Type: 3-state; Operating Temperature: -40C - 125C; ComponentLink1Description: Digikey; ComponentLink1URL: https://www.digikey.ca/en/products/detail/nexperia-usa-inc/74LVC125AD-118/946677; ComponentLink2Description: Datasheet; ComponentLink2URL: https://assets.nexperia.com/documents/data-sheet/74LVC125A.pdf; ComponentLink3Description: Mfr; ComponentLink3URL: https://www.nexperia.com/products/analog-logic-ics/logic/buffers-inverters-transceivers/buffers/74LVC125AD.html; ComponentLink4Description: Octopart; ComponentLink4URL: https://octopart.com/74lvc125ad%2C118-nexperia-78737785?r=sp

## Sheet CLOCK.SchDoc
size 558 x 431 mm; SheetNumber: 5; SheetTotal: 25; Sheet_Name: CLOCK; Size: 11x17
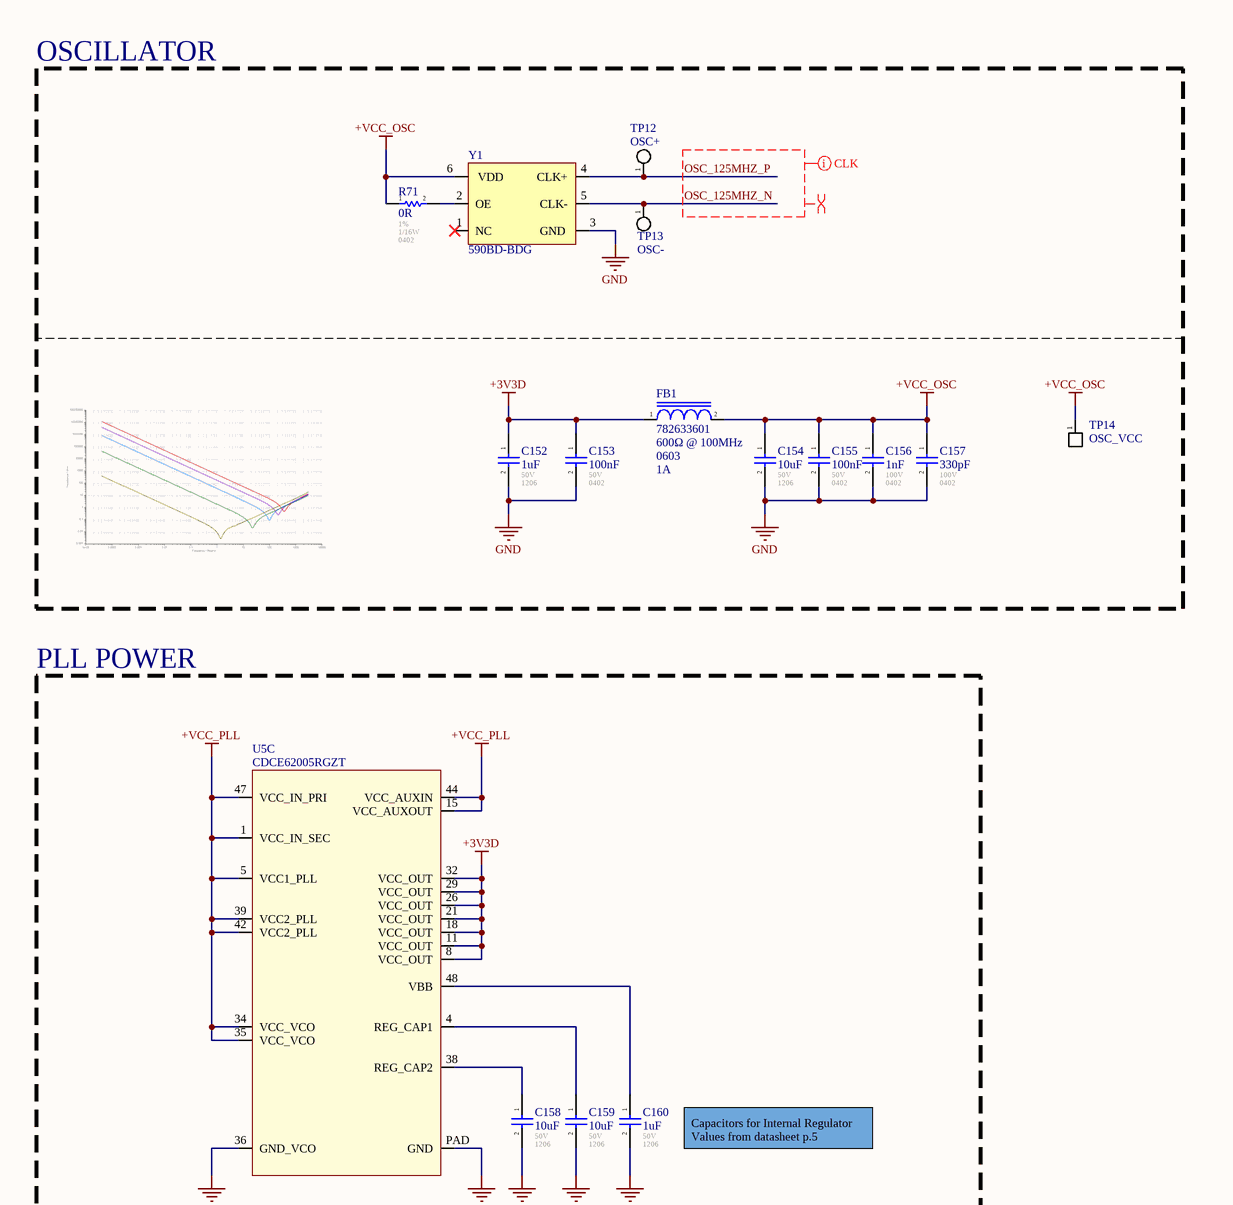
[diagram p47: CLOCK.SchDoc, top left]
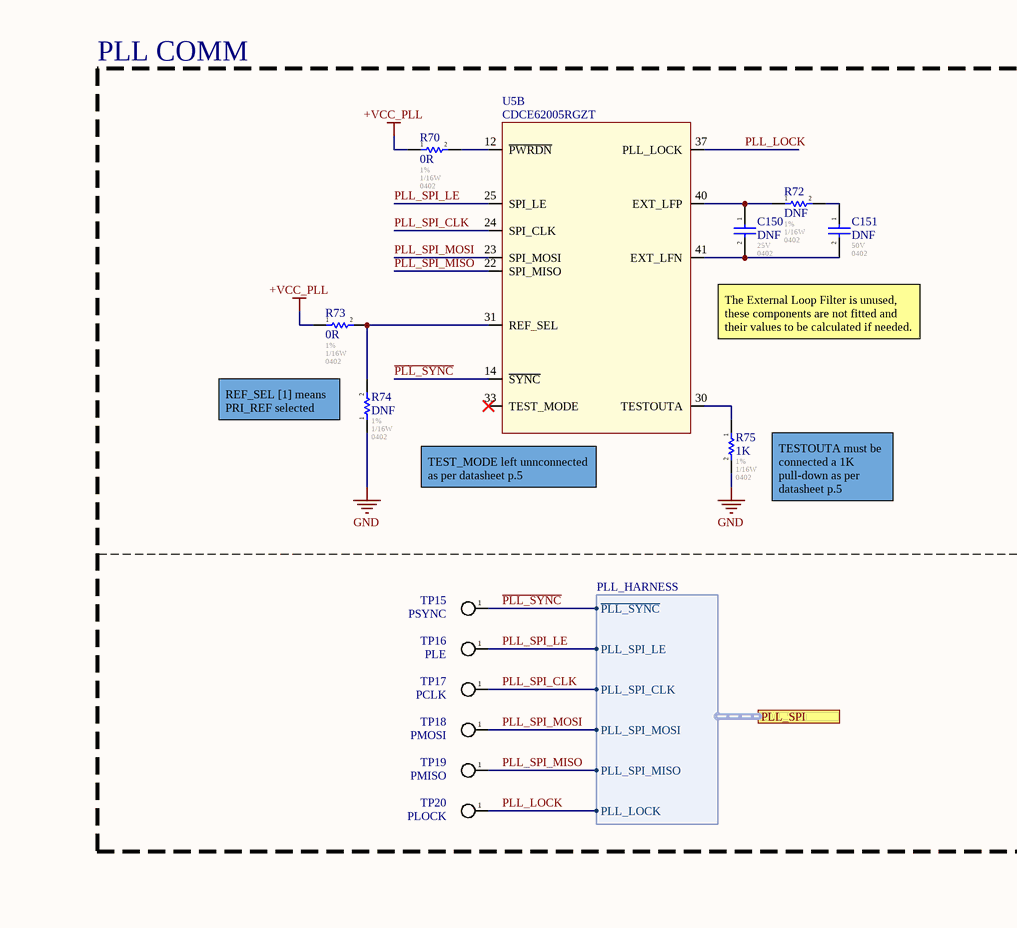
[diagram p48: CLOCK.SchDoc, top right]
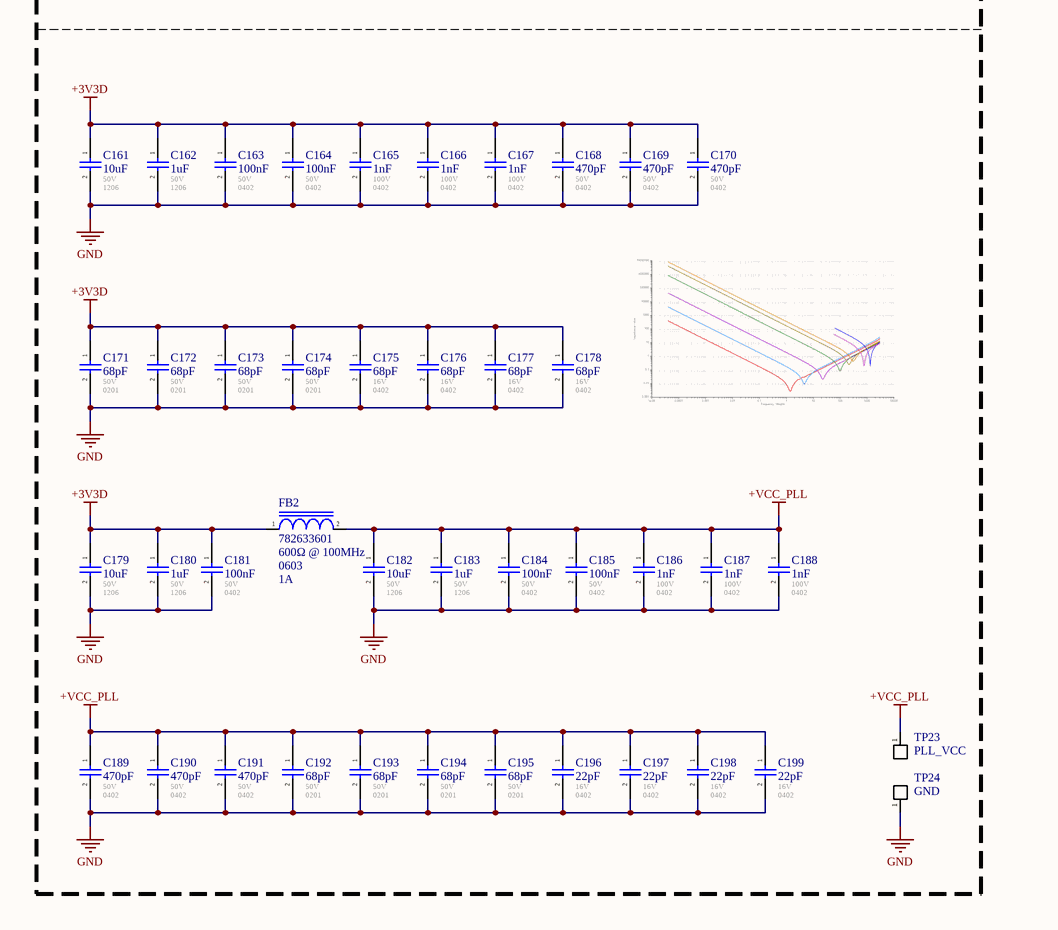
[diagram p49: CLOCK.SchDoc, bottom left]
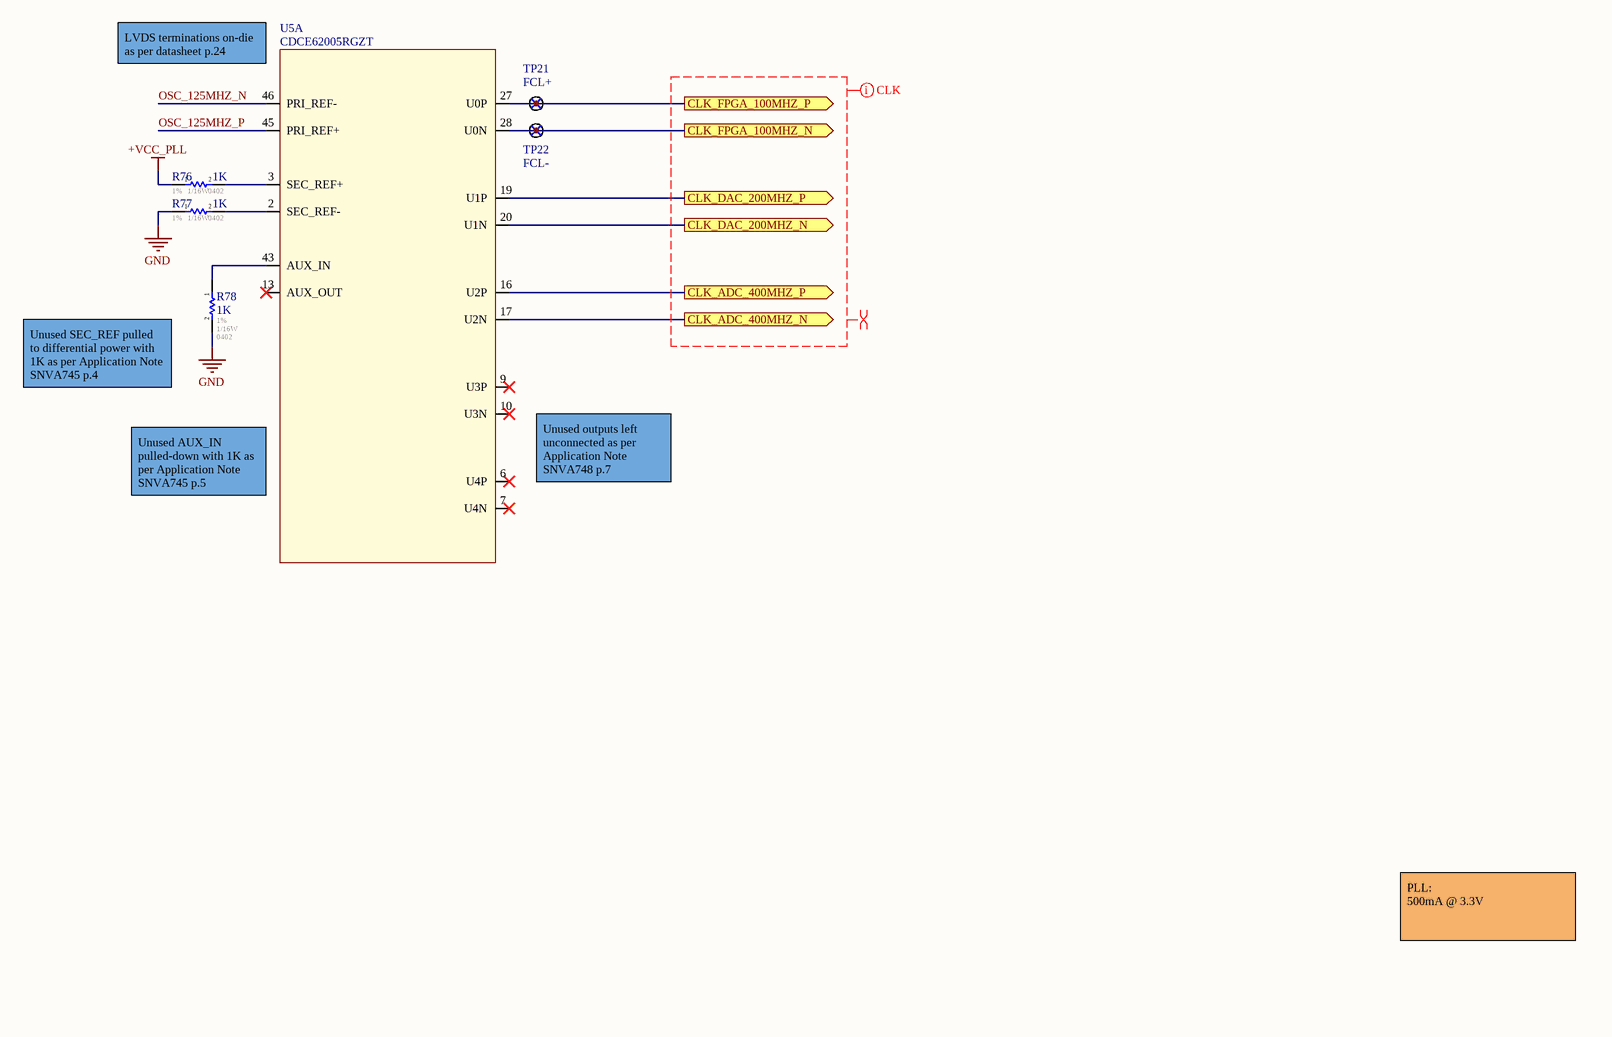
[diagram p50: CLOCK.SchDoc, bottom right]

### Parts
C150  DNF  Voltage - Rated: 25V  Footprint: 0402  [CAP_0402]
C151  DNF  Voltage - Rated: 50V  Footprint: 0402  [CAP_0402]
C152  1uF  Voltage - Rated: 50V  Footprint: 1206  [CAP_1206]
C153  100nF  Voltage - Rated: 50V  Footprint: 0402  [CAP_0402]
C154  10uF  Voltage - Rated: 50V  Footprint: 1206  [CAP_1206]
C155  100nF  Voltage - Rated: 50V  Footprint: 0402  [CAP_0402]
C156  1nF  Voltage - Rated: 100V  Footprint: 0402  [CAP_0402]
C157  330pF  Voltage - Rated: 100V  Footprint: 0402  [CAP_0402]
C158  10uF  Voltage - Rated: 50V  Footprint: 1206  [CAP_1206]
C159  10uF  Voltage - Rated: 50V  Footprint: 1206  [CAP_1206]
C160  1uF  Voltage - Rated: 50V  Footprint: 1206  [CAP_1206]
C161  10uF  Voltage - Rated: 50V  Footprint: 1206  [CAP_1206]
C162  1uF  Voltage - Rated: 50V  Footprint: 1206  [CAP_1206]
C163  100nF  Voltage - Rated: 50V  Footprint: 0402  [CAP_0402]
C164  100nF  Voltage - Rated: 50V  Footprint: 0402  [CAP_0402]
C165  1nF  Voltage - Rated: 100V  Footprint: 0402  [CAP_0402]
C166  1nF  Voltage - Rated: 100V  Footprint: 0402  [CAP_0402]
C167  1nF  Voltage - Rated: 100V  Footprint: 0402  [CAP_0402]
C168  470pF  Voltage - Rated: 50V  Footprint: 0402  [CAP_0402]
C169  470pF  Voltage - Rated: 50V  Footprint: 0402  [CAP_0402]
C170  470pF  Voltage - Rated: 50V  Footprint: 0402  [CAP_0402]
C171  68pF  Voltage - Rated: 50V  Footprint: 0201  [CAP_0402]
C172  68pF  Voltage - Rated: 50V  Footprint: 0201  [CAP_0402]
C173  68pF  Voltage - Rated: 50V  Footprint: 0201  [CAP_0402]
C174  68pF  Voltage - Rated: 50V  Footprint: 0201  [CAP_0402]
C175  68pF  Voltage - Rated: 16V  Footprint: 0402  [CAP_0402]
C176  68pF  Voltage - Rated: 16V  Footprint: 0402  [CAP_0402]
C177  68pF  Voltage - Rated: 16V  Footprint: 0402  [CAP_0402]
C178  68pF  Voltage - Rated: 16V  Footprint: 0402  [CAP_0402]
C179  10uF  Voltage - Rated: 50V  Footprint: 1206  [CAP_1206]
C180  1uF  Voltage - Rated: 50V  Footprint: 1206  [CAP_1206]
C181  100nF  Voltage - Rated: 50V  Footprint: 0402  [CAP_0402]
C182  10uF  Voltage - Rated: 50V  Footprint: 1206  [CAP_1206]
C183  1uF  Voltage - Rated: 50V  Footprint: 1206  [CAP_1206]
C184  100nF  Voltage - Rated: 50V  Footprint: 0402  [CAP_0402]
C185  100nF  Voltage - Rated: 50V  Footprint: 0402  [CAP_0402]
C186  1nF  Voltage - Rated: 100V  Footprint: 0402  [CAP_0402]
C187  1nF  Voltage - Rated: 100V  Footprint: 0402  [CAP_0402]
C188  1nF  Voltage - Rated: 100V  Footprint: 0402  [CAP_0402]
C189  470pF  Voltage - Rated: 50V  Footprint: 0402  [CAP_0402]
C190  470pF  Voltage - Rated: 50V  Footprint: 0402  [CAP_0402]
C191  470pF  Voltage - Rated: 50V  Footprint: 0402  [CAP_0402]
C192  68pF  Voltage - Rated: 50V  Footprint: 0201  [CAP_0402]
C193  68pF  Voltage - Rated: 50V  Footprint: 0201  [CAP_0402]
C194  68pF  Voltage - Rated: 50V  Footprint: 0201  [CAP_0402]
C195  68pF  Voltage - Rated: 50V  Footprint: 0201  [CAP_0402]
C196  22pF  Voltage - Rated: 16V  Footprint: 0402  [CAP_0402]
C197  22pF  Voltage - Rated: 16V  Footprint: 0402  [CAP_0402]
C198  22pF  Voltage - Rated: 16V  Footprint: 0402  [CAP_0402]
C199  22pF  Voltage - Rated: 16V  Footprint: 0402  [CAP_0402]
FB1  782633601  Impedance @ Freq: 600Ω @ 100MHz  Package / Case: 0603  Current Rating: 1A  [IND_0603]
FB2  782633601  Impedance @ Freq: 600Ω @ 100MHz  Package / Case: 0603  Current Rating: 1A  [IND_0603]
R70  0R  Tolerance: 1%  Power: 1/16W  Package / Case: 0402  [RES_0402]
R71  0R  Tolerance: 1%  Power: 1/16W  Package / Case: 0402  [RES_0402]
R72  DNF  Tolerance: 1%  Power: 1/16W  Package / Case: 0402  [RES_0402]
R73  0R  Tolerance: 1%  Power: 1/16W  Package / Case: 0402  [RES_0402]
R74  DNF  Tolerance: 1%  Power: 1/16W  Package / Case: 0402  [RES_0402]
R75  1K  Tolerance: 1%  Power: 1/16W  Package / Case: 0402  [RES_0402]
R76  1K  Tolerance: 1%  Power: 1/16W  Package / Case: 0402  [RES_0402]
R77  1K  Tolerance: 1%  Power: 1/16W  Package / Case: 0402  [RES_0402]
R78  1K  Tolerance: 1%  Power: 1/16W  Package / Case: 0402  [RES_0402]
TP12  OSC+  [TP_PAD_SMALL]  (no BOM)
TP13  OSC-  [TP_PAD_SMALL]  (no BOM)
TP14  OSC_VCC  [TP_PAD]  (no BOM)
TP15  PSYNC  [TP_PAD_SMALL]  (no BOM)
TP16  PLE  [TP_PAD_SMALL]  (no BOM)
TP17  PCLK  [TP_PAD_SMALL]  (no BOM)
TP18  PMOSI  [TP_PAD_SMALL]  (no BOM)
TP19  PMISO  [TP_PAD_SMALL]  (no BOM)
TP20  PLOCK  [TP_PAD_SMALL]  (no BOM)
TP21  FCL+  [TP_PAD_TINY]  (no BOM)
TP22  FCL-  [TP_PAD_TINY]  (no BOM)
TP23  PLL_VCC  [TP_PAD]  (no BOM)
TP24  GND  [TP_PAD]  (no BOM)
U5  CDCE62005RGZT  [TIM_CDCE62005RGZT]  (parts A,B,C of 3)
Y1  590BD-BDG  [OSC_590BD-BDG]

### Blocks framed on the sheet
OSCILLATOR: C152-C157 FB1 R71 TP12-TP14 Y1
PLL COMM: C150 C151 R70 R72-R75 TP15-TP20 U5
PLL POWER: C158-C199 FB2 TP23 TP24 U5

### Ports
CLK_ADC_400MHZ_N (out), CLK_ADC_400MHZ_P (out), CLK_DAC_200MHZ_N (out), CLK_DAC_200MHZ_P (out), CLK_FPGA_100MHZ_N (out), CLK_FPGA_100MHZ_P (out), PLL_SPI (harness PLL_HARNESS)

### Harnesses
PLL_HARNESS: ~{PLL_SYNC}, PLL_SPI_LE, PLL_SPI_CLK, PLL_SPI_MOSI, PLL_SPI_MISO, PLL_LOCK

### Nets
+3V3D: C152.1 C153.1 C161.1 C162.1 C163.1 C164.1 C165.1 C166.1 C167.1 C168.1 C169.1 C170.1 C171.1 C172.1 C173.1 C174.1 C175.1 C176.1 C177.1 C178.1 C179.1 C180.1 C181.1 FB1.1 FB2.1 U5.8(VCC_OUT) U5.11(VCC_OUT) U5.18(VCC_OUT) U5.21(VCC_OUT) U5.26(VCC_OUT) U5.29(VCC_OUT) U5.32(VCC_OUT)
+VCC_OSC: C154.1 C155.1 C156.1 C157.1 FB1.2 R71.1 TP14.1(A) Y1.6(VDD)
+VCC_PLL: C182.1 C183.1 C184.1 C185.1 C186.1 C187.1 C188.1 C189.1 C190.1 C191.1 C192.1 C193.1 C194.1 C195.1 C196.1 C197.1 C198.1 C199.1 FB2.2 R70.1 R73.1 R76.1 TP23.1(A) U5.1(VCC_IN_SEC) U5.5(VCC1_PLL) U5.15(VCC_AUXOUT) U5.34(VCC_VCO) U5.35(VCC_VCO) U5.39(VCC2_PLL) U5.42(VCC2_PLL) U5.44(VCC_AUXIN) U5.47(VCC_IN_PRI)
GND: C152.2 C153.2 C154.2 C155.2 C156.2 C157.2 C158.2 C159.2 C160.2 C161.2 C162.2 C163.2 C164.2 C165.2 C166.2 C167.2 C168.2 C169.2 C170.2 C171.2 C172.2 C173.2 C174.2 C175.2 C176.2 C177.2 C178.2 C179.2 C180.2 C181.2 C182.2 C183.2 C184.2 C185.2 C186.2 C187.2 C188.2 C189.2 C190.2 C191.2 C192.2 C193.2 C194.2 C195.2 C196.2 C197.2 C198.2 C199.2 R74.1 R75.2 R77.1 R78.2 TP24.1(A) U5.36(GND_VCO) U5.PAD(GND) Y1.3(GND)
~{PLL_SYNC}: TP15.1(A) U5.14(~{SYNC}) ; port PLL_SPI.~{PLL_SYNC}
CLK_ADC_400MHZ_N: U5.17(U2N) ; port CLK_ADC_400MHZ_N
CLK_ADC_400MHZ_P: U5.16(U2P) ; port CLK_ADC_400MHZ_P
CLK_DAC_200MHZ_N: U5.20(U1N) ; port CLK_DAC_200MHZ_N
CLK_DAC_200MHZ_P: U5.19(U1P) ; port CLK_DAC_200MHZ_P
CLK_FPGA_100MHZ_N: TP22.1(A) U5.28(U0N) ; port CLK_FPGA_100MHZ_N
CLK_FPGA_100MHZ_P: TP21.1(A) U5.27(U0P) ; port CLK_FPGA_100MHZ_P
OSC_125MHZ_N: TP13.1(A) U5.46(PRI_REF-) Y1.5(CLK-)  [project net OSC_125MHZ_N_5]
OSC_125MHZ_P: TP12.1(A) U5.45(PRI_REF+) Y1.4(CLK+)  [project net OSC_125MHZ_P_5]
PLL_LOCK: TP20.1(A) U5.37(PLL_LOCK) ; port PLL_SPI.PLL_LOCK
PLL_SPI_CLK: TP17.1(A) U5.24(SPI_CLK) ; port PLL_SPI.PLL_SPI_CLK
PLL_SPI_LE: TP16.1(A) U5.25(SPI_LE) ; port PLL_SPI.PLL_SPI_LE
PLL_SPI_MISO: TP19.1(A) U5.22(SPI_MISO) ; port PLL_SPI.PLL_SPI_MISO
PLL_SPI_MOSI: TP18.1(A) U5.23(SPI_MOSI) ; port PLL_SPI.PLL_SPI_MOSI
NetC150_1: C150.1 R72.1 U5.40(EXT_LFP)
NetC150_2: C150.2 C151.2 U5.41(EXT_LFN)
NetC151_1: C151.1 R72.2
NetC158_1: C158.1 U5.38(REG_CAP2)
NetC159_1: C159.1 U5.4(REG_CAP1)
NetC160_1: C160.1 U5.48(VBB)
NetR70_2: R70.2 U5.12(~{PWRDN})
NetR71_2: R71.2 Y1.2(OE)
NetR73_2: R73.2 R74.2 U5.31(REF_SEL)
NetR75_1: R75.1 U5.30(TESTOUTA)
NetR76_2: R76.2 U5.3(SEC_REF+)
NetR77_2: R77.2 U5.2(SEC_REF-)
NetR78_1: R78.1 U5.43(AUX_IN)

Not connected (* = marked no-connect by the designer): U5 6(U4P)* 7(U4N)* 9(U3P)* 10(U3N)* 13(AUX_OUT)* 33(TEST_MODE)*; Y1 1(NC)*

### Layout directives
differential pair: (no net found under the mark), OSC_125MHZ_N, OSC_125MHZ_P
net class CLK: (no net found under the mark), OSC_125MHZ_N, OSC_125MHZ_P

### Notes on the sheet
- The External Loop Filter is unused, these components are not fitted and their values to be calculated if needed.
- (near R74) REF_SEL [1] means PRI_REF selected
- TEST_MODE left unnconnected as per datasheet p.5
- (near R75) TESTOUTA must be connected a 1K pull-down as per datasheet p.5
- (near U5) LVDS terminations on-die as per datasheet p.24
- Capacitors for Internal Regulator
  Values from datasheet p.5
- (near R78) Unused SEC_REF pulled to differential power with 1K as per Application Note SNVA745 p.4
- (near U5) Unused outputs left unconnected as per Application Note SNVA748 p.7
- (near U5) Unused AUX_IN pulled-down with 1K as per Application Note SNVA745 p.5
- PLL:
  500mA @ 3.3V
- Sheet Name
- Project Title
- Global Project
- Revision
- Size
- Date
- Group
- Sheet
- of
- Filename
- Designers

### Library data of the parts
C150 = CAP_CER: Temperature Coefficient: X7R; Operating Temperature: *; Mfr: *; ComponentLink1Description: Digikey; ComponentLink1URL: [Digikey Link]; Digikey Part No: *; ComponentLink2Description: Datasheet; ComponentLink2URL: [Datasheet Link]
C151 = CAP_CER: 0402 100nF X7R Ceramic Capacitor; Operating Temperature: *; Temperature Coefficient: X7R; Mfr: *; ComponentLink1Description: Digikey; ComponentLink1URL: [Digikey Link]; Digikey Part No: *; ComponentLink2Description: Datasheet; ComponentLink2URL: [Datasheet Link]
C152 C160 C162 C180 C183 = CAP_CER: GCJ31CR71H105KA12L / 1206 1uF 10% X7R Ceramic Capacitor; Mfr: Murata; Operating Temperature: -55C - 125C; Temperature Coefficient: X7R; ComponentLink1Description: Digikey; ComponentLink1URL: [Digikey Link]; Part#: GCJ31CR71H105KA12L; ComponentLink2Description: Datasheet; ComponentLink2URL: [Datasheet Link]; Tolerance: 10%; Ratings: AEC-Q200
C153 C155 C163 C164 C181 C184 C185 = CAP_CER: as C369 on sheet USER_IO; Operating Temperature: -55C - 125C; Temperature Coefficient: X7R; ComponentLink1Description: Digikey; ComponentLink1URL: [Digikey Link]; Part#: GCM155R71H104KE02J; ComponentLink2Description: Datasheet; ComponentLink2URL: [Datasheet Link]; Tolerance: 10%; Ratings: AEC-Q200
C154 C158 C159 C161 C179 C182 = CAP_CER: as C370 on sheet USER_IO; Operating Temperature: -55C - 85C; Temperature Coefficient: X5R; ComponentLink1Description: Digikey; ComponentLink1URL: [Digikey Link]; ComponentLink2Description: Datasheet; ComponentLink2URL: [Datasheet Link]; Tolerance: 10%; Ratings: AEC-Q200; Part#: GRT31CR61H106KE01L
C156 C165-C167 C186-C188 = CAP_CER: as C373 on sheet USER_IO; Operating Temperature: -55C - 125C; Temperature Coefficient: X7R; ComponentLink1Description: Digikey; ComponentLink1URL: [Digikey Link]; Part#: GCM155R72A102KA37D; ComponentLink2Description: Datasheet; ComponentLink2URL: [Datasheet Link]; Tolerance: 10%; Ratings: AEC-Q200
C157 = CAP_CER: GCM155R72A331KA37D / 0402 330pF 10% X7R Ceramic Capacitor; Mfr: Murata; Operating Temperature: -55C - 125C; Temperature Coefficient: X7R; ComponentLink1Description: Digikey; ComponentLink1URL: https://www.digikey.ca/en/products/detail/murata-electronics/GCM155R72A331KA37D/2591348; Part#: GCM155R72A331KA37D; ComponentLink2Description: Datasheet; ComponentLink2URL: https://search.murata.co.jp/Ceramy/image/img/A01X/G101/ENG/GCM155R72A331KA37-01A.pdf; Tolerance: 10%; Ratings: AEC-Q200; ComponentLink3Description: Murata; ComponentLink3URL: https://www.murata.com/en-us/products/productdetail?partno=GCM155R72A331KA37%23; ComponentLink4Description: Octopart; ComponentLink4URL: https://octopart.com/gcm155r72a331ka37d-murata-18331888?r=sp; Supplier 1: Arrow Electronics; Supplier Part Number 1: GCM155R72A331KA37D
C168-C170 C189-C191 = CAP_CER: GCM155R71H471KA37J / 0402 470pF 10% X7R Ceramic Capacitor; Mfr: Murata; Operating Temperature: -55C - 125C; Temperature Coefficient: X7R; ComponentLink1Description: Digikey; ComponentLink1URL: https://www.digikey.ca/en/products/detail/murata-electronics/GCM155R71H471KA37J/2591324; Part#: GCM155R71H471KA37J; ComponentLink2Description: Datasheet; ComponentLink2URL: https://search.murata.co.jp/Ceramy/image/img/A01X/G101/ENG/GCM155R71H471KA37-01A.pdf; Tolerance: 10%; Ratings: AEC-Q200; ComponentLink3Description: Murata; ComponentLink3URL: https://www.murata.com/en-us/products/productdetail?partno=GCM155R71H471KA37%23; ComponentLink4Description: Octopart; ComponentLink4URL: https://octopart.com/gcm155r71h471ka37j-murata-17803389?r=sp
C171-C174 C192-C195 = CAP_CER: 0201 68pF 5% C0G 50V Ceramic Capacitor / CGA1A2C0G1H680J030BA; Mfr: TDK; Operating Temperature: -55C - 125C; Temperature Coefficient: C0G; ComponentLink1Description: Digikey; ComponentLink1URL: https://www.digikey.ca/en/products/detail/tdk-corporation/CGA1A2C0G1H680J030BA/3648597; Part#: CGA1A2C0G1H680J030BA; ComponentLink2Description: Datasheet; ComponentLink2URL: https://product.tdk.com/system/files/dam/doc/product/capacitor/ceramic/mlcc/charasheet/cga1a2c0g1h680j030ba.pdf; Tolerance: 5%; Ratings: AEC-Q200; ComponentLink3Description: Octopart; ComponentLink3URL: https://octopart.com/cga1a2c0g1h680j030ba-tdk-26014371?r=sp; ComponentLink4Description: TDK; ComponentLink4URL: https://product.tdk.com/en/search/capacitor/ceramic/mlcc/info?part_no=CGA1A2C0G1H680J030BA; Supplier 1: Arrow Electronics; Supplier Part Number 1: CGA1A2C0G1H680J030BA
C175-C178 C196-C199 = CAP_CER: 0402 22pF 10% X7R 16V Ceramic Capacitor / C0402C220K4RACAUTO; Mfr: KEMET; Operating Temperature: -55C - 125C; Temperature Coefficient: X7R; ComponentLink1Description: Digikey; ComponentLink1URL: https://www.digikey.ca/en/products/detail/kemet/c0402c220k4racauto/11676432; Part#: C0402C220K4RACAUTO; ComponentLink2Description: Datasheet; ComponentLink2URL: https://connect.kemet.com:7667/gateway/IntelliData-ComponentDocumentation/1.0/download/datasheet/C0402C220K4RACAUTO; Tolerance: 10%; Ratings: AEC-Q200; ComponentLink3Description: Octopart; ComponentLink3URL: https://octopart.com/c0402c220k4racauto-kemet-91893749?r=sp; ComponentLink4Description: Kemet; ComponentLink4URL: https://www.kemet.com/en/us/capacitors/ceramic/product/C0402C220K4RACAUTO.html; ComponentLink5Description: Specsheet; ComponentLink5URL: https://search.kemet.com/component-documentation/download/specsheet/C0402C220K4RACAUTO; Supplier 1: Mouser; Supplier Part Number 1: 80-C0402C220K4RAUTO
FB1 FB2 = FERRITE_BEAD: 600 Ohms @ 100 MHz 1 Signal Line Ferrite Bead 0603 (1608 Metric) 1A 200mOhm; Manufacturer: Wurth Elektronik; Resistance: 200mR; Operating Temperature: -55C - 125C; Rating: AEC-Q200; ComponentLink1Description: Digikey; ComponentLink1URL: https://www.digikey.ca/en/products/detail/w%C3%BCrth-elektronik/782633601/5168802; ComponentLink3Description: Octopart; ComponentLink3URL: https://octopart.com/782633601-wurth+elektronik-56466764; Supplier 1: Digikey; Supplier Part Number 1: 732-6703-1-ND; ComponentLink5Description: Datasheet; ComponentLink5URL: https://www.we-online.com/components/products/datasheet/782633601.pdf
R70-R78 = RESISTOR: Automotive: AEC-Q200; Operating Temperature: *; # Digikey: *; ComponentLink1Description: Digikey; ComponentLink1URL: *; # Manufacturer: *
TP12 TP13 TP15-TP20 = TESTPOINT_PAD_SMALL: Test Point
TP14 TP23 TP24 = TESTPOINT_PAD: Test Point
TP21 TP22 = TESTPOINT_PAD_TINY: Test Point
U5 = TIM_CDCE62005RGZT: TIM - CLK SYNTH JITTER CLEANER 3:5 - QFN-48; Voltage: 3 V ~ 3.6 V; Mfg: Texas Instruments; Current: *; Power: *; Mfg Part Number: CDCE62005RGZT; HelpURL: http://www.ti.com/lit/ds/symlink/cdce62005.pdf; CreatedBy: Jonathan Bouchard; Temperature: -40°C ~ 85°C; Value: *; Precision: *; Package: QFN-48; Supplier 1: Digikey; Supplier Part Number 1: 296-23947-1-ND
Y1 = OSC_590BD-BDG: TIM - OSC PROG 125MHz ~ 214.999MHz LVDS 3.3V 7PPM EN/DS - 6-SMD; Manufacturer #1: Silicon Labs; Current Rating: 100 mA (supply); Note: Spécifié la fréquence lors de la commande; Voltage rating: 3.3V (supply); Polarized: Yes; Value: ±7ppm (freq Stability), ±20ppm (freq stability total); Magnetic Material: UNKNOWN; GRAMS Lib Spec: 2.8; Manufacturer #2: *; Power Max: *; Part Number #1: 590BD-BDG; Part Number #2: *; HelpURL: https://www.silabs.com/documents/public/data-sheets/Si590-591.pdf; Supplier 1: Digi-Key; Supplier Part Number 1: 590BD-BDG-ND; Assembly Type: SMD; Temperature: -40°C ~ 85°C; Package: 6-SMD; CreatedBy/Date: from 590BD-CDG; Tolerance: *; VerifiedBy: Caroline Paulin / 3/10/2019; Cryo: UNKNOWN